# Altium project Switchberry.PrjPcb (part 1 of 3)
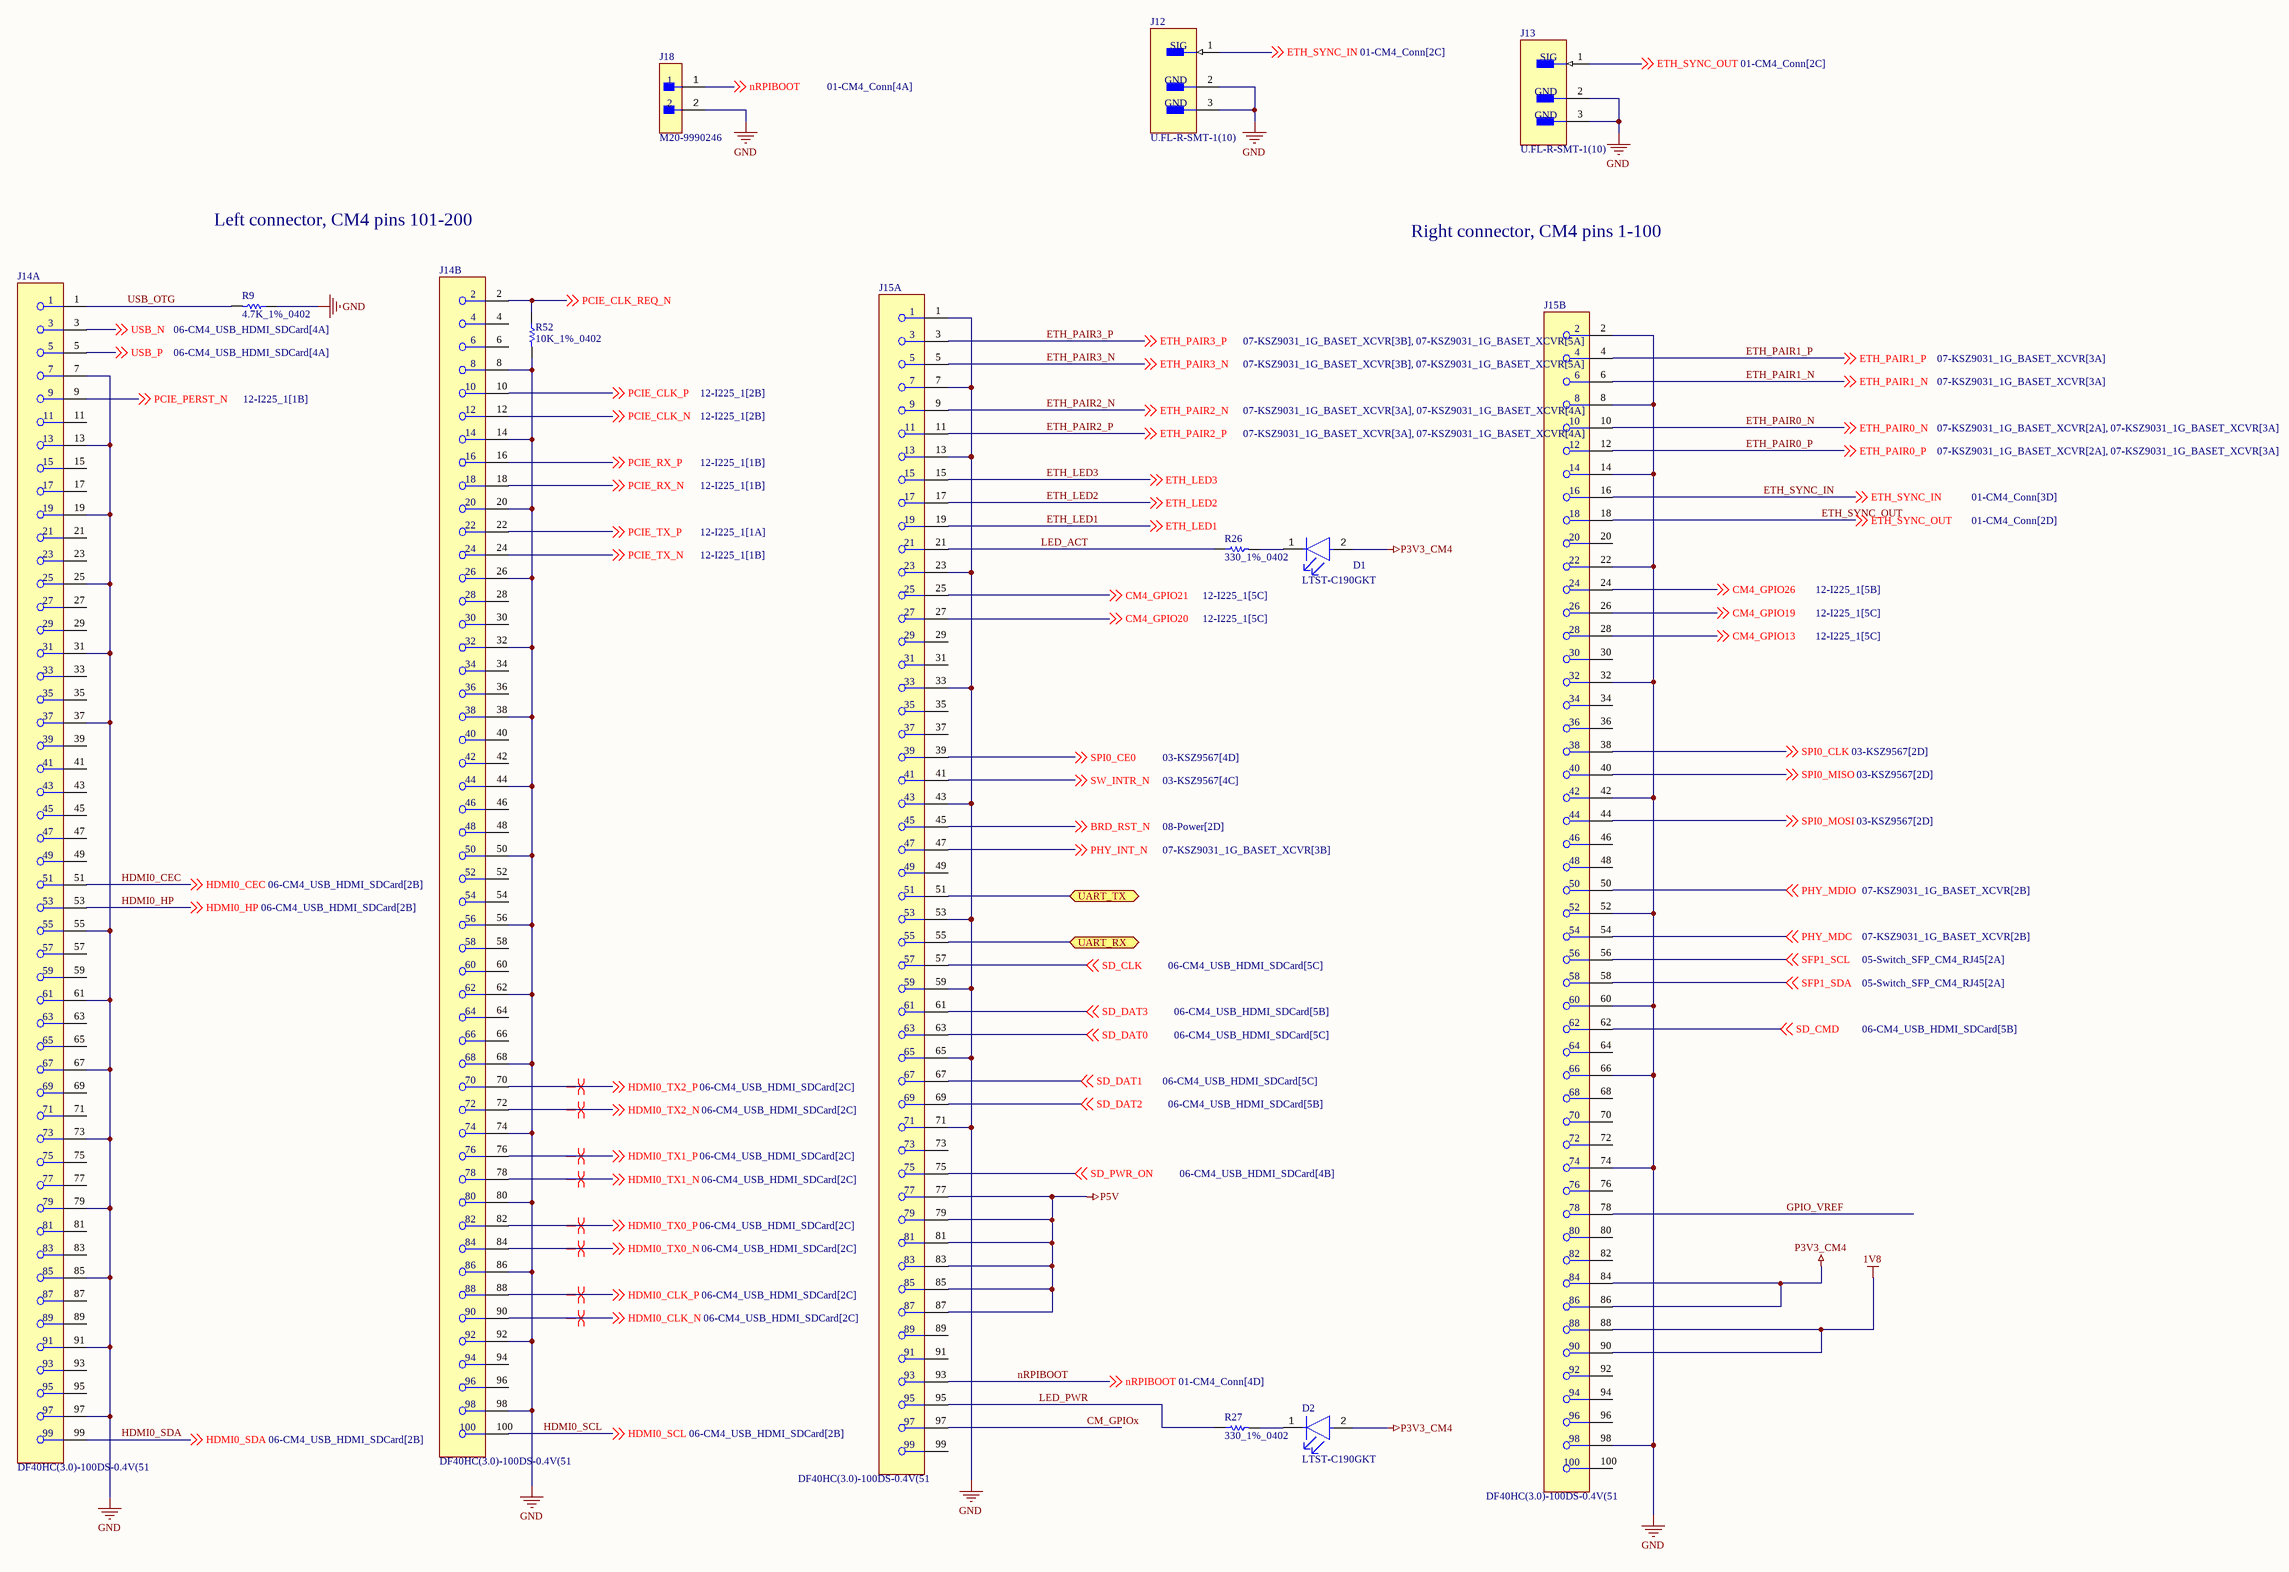
[diagram p0: 01-CM4_Conn.SchDoc]
10 sheets, 320 parts. Net scope: global (net labels, ports and power ports of the same name join across sheets).
Board file: Switchberry.PcbDoc
Sheets:
  01-CM4_Conn.SchDoc
  03-KSZ9567.SchDoc
  04-Switch_RJ45.SchDoc
  05-Switch_SFP_CM4_RJ45.SchDoc
  06-CM4_USB_HDMI_SDCard.SchDoc
  07-KSZ9031_1G_BASET_XCVR.SchDoc
  08-Power.SchDoc
  10-RJ45_Protection.SchDoc
  12-I225_1.SchDoc
  13-I225_2.SchDoc

## Sheet 01-CM4_Conn.SchDoc
size C; SheetNumber: 1; SheetTotal: 13

### Parts
D1  LTST-C190GKT  [FP-LTST-C190GKT-MFG]
D2  LTST-C190GKT  [FP-LTST-C190GKT-MFG]
J12  U.FL-R-SMT-1(10)  [FP-U_FL-R-SMT-1_10-MFG]
J13  U.FL-R-SMT-1(10)  [FP-U_FL-R-SMT-1_10-MFG]
J14  DF40HC(3.0)-100DS-0.4V(51  [FP-DF40HC_3_0_-100DS-0_4V-MFG]  (parts A,B of 2)
J15  DF40HC(3.0)-100DS-0.4V(51  [FP-DF40HC_3_0_-100DS-0_4V-MFG]  (parts A,B of 2)
J18  M20-9990246  [FP-M20-9990246-MFG]
R9  4.7K_1%_0402  [RESC1005X40X25NL10T10]
R26  330_1%_0402  [RESC1005X40X25NL10T10]
R27  330_1%_0402  [RESC1005X40X25NL10T10]
R52  10K_1%_0402  [RESC1005X40X25NL10T10]

### Ports
UART_RX (bidir), UART_TX (bidir)

### Nets
1V8: J15.88 J15.90
GND: J12.2(GND) J12.3(GND) J13.2(GND) J13.3(GND) J14.7 J14.8 J14.13 J14.14 J14.19 J14.20 J14.25 J14.26 J14.31 J14.32 J14.37 J14.38 J14.44 J14.50 J14.55 J14.56 J14.61 J14.62 J14.67 J14.68 J14.73 J14.74 J14.79 J14.80 J14.85 J14.86 J14.91 J14.92 J14.97 J14.98 J15.1 J15.2 J15.7 J15.8 J15.13 J15.14 J15.22 J15.23 J15.32 J15.33 J15.42 J15.43 J15.52 J15.53 J15.59 J15.60 J15.65 J15.66 J15.71 J15.74 J15.98 J18.2 R9.1 R52.2
P3V3_CM4: D1.2(A) D2.2(A) J15.84 J15.86
P5V: J15.77 J15.79 J15.81 J15.83 J15.85 J15.87
BRD_RST_N: J15.45 ; off-sheet BRD_RST_N
CM4_GPIO13: J15.28 ; off-sheet CM4_GPIO13
CM4_GPIO19: J15.26 ; off-sheet CM4_GPIO19
CM4_GPIO20: J15.27 ; off-sheet CM4_GPIO20
CM4_GPIO21: J15.25 ; off-sheet CM4_GPIO21
CM4_GPIO26: J15.24 ; off-sheet CM4_GPIO26
CM_GPIOx: J15.97
ETH_LED1: J15.19 ; off-sheet ETH_LED1
ETH_LED2: J15.17 ; off-sheet ETH_LED2
ETH_LED3: J15.15 ; off-sheet ETH_LED3
ETH_PAIR0_N: J15.10 ; off-sheet ETH_PAIR0_N
ETH_PAIR0_P: J15.12 ; off-sheet ETH_PAIR0_P
ETH_PAIR1_N: J15.6 ; off-sheet ETH_PAIR1_N
ETH_PAIR1_P: J15.4 ; off-sheet ETH_PAIR1_P
ETH_PAIR2_N: J15.9 ; off-sheet ETH_PAIR2_N
ETH_PAIR2_P: J15.11 ; off-sheet ETH_PAIR2_P
ETH_PAIR3_N: J15.5 ; off-sheet ETH_PAIR3_N
ETH_PAIR3_P: J15.3 ; off-sheet ETH_PAIR3_P
ETH_SYNC_IN: J12.1(SIG) J15.16 ; off-sheet ETH_SYNC_IN
ETH_SYNC_OUT: J13.1(SIG) J15.18 ; off-sheet ETH_SYNC_OUT
GPIO_VREF: J15.78
HDMI0_CEC: J14.51 ; off-sheet HDMI0_CEC
HDMI0_CLK_N: J14.90 ; off-sheet HDMI0_CLK_N
HDMI0_CLK_P: J14.88 ; off-sheet HDMI0_CLK_P
HDMI0_HP: J14.53 ; off-sheet HDMI0_HP
HDMI0_SCL: J14.100 ; off-sheet HDMI0_SCL
HDMI0_SDA: J14.99 ; off-sheet HDMI0_SDA
HDMI0_TX0_N: J14.84 ; off-sheet HDMI0_TX0_N
HDMI0_TX0_P: J14.82 ; off-sheet HDMI0_TX0_P
HDMI0_TX1_N: J14.78 ; off-sheet HDMI0_TX1_N
HDMI0_TX1_P: J14.76 ; off-sheet HDMI0_TX1_P
HDMI0_TX2_N: J14.72 ; off-sheet HDMI0_TX2_N
HDMI0_TX2_P: J14.70 ; off-sheet HDMI0_TX2_P
LED_ACT: J15.21 R26.1
LED_PWR: J15.95 R27.1
nRPIBOOT: J15.93 J18.1 ; off-sheet nRPIBOOT
PCIE_CLK_N: J14.12 ; off-sheet PCIE_CLK_N
PCIE_CLK_P: J14.10 ; off-sheet PCIE_CLK_P
PCIE_CLK_REQ_N: J14.2 R52.1 ; off-sheet PCIE_CLK_REQ_N
PCIE_PERST_N: J14.9 ; off-sheet PCIE_PERST_N
PCIE_RX_N: J14.18 ; off-sheet PCIE_RX_N
PCIE_RX_P: J14.16 ; off-sheet PCIE_RX_P
PCIE_TX_N: J14.24 ; off-sheet PCIE_TX_N
PCIE_TX_P: J14.22 ; off-sheet PCIE_TX_P
PHY_INT_N: J15.47 ; off-sheet PHY_INT_N
PHY_MDC: J15.54 ; off-sheet PHY_MDC
PHY_MDIO: J15.50 ; off-sheet PHY_MDIO
SD_CLK: J15.57 ; off-sheet SD_CLK
SD_CMD: J15.62 ; off-sheet SD_CMD
SD_DAT0: J15.63 ; off-sheet SD_DAT0
SD_DAT1: J15.67 ; off-sheet SD_DAT1
SD_DAT2: J15.69 ; off-sheet SD_DAT2
SD_DAT3: J15.61 ; off-sheet SD_DAT3
SD_PWR_ON: J15.75 ; off-sheet SD_PWR_ON
SFP1_SCL: J15.56 ; off-sheet SFP1_SCL
SFP1_SDA: J15.58 ; off-sheet SFP1_SDA
SPI0_CE0: J15.39 ; off-sheet SPI0_CE0
SPI0_CLK: J15.38 ; off-sheet SPI0_CLK
SPI0_MISO: J15.40 ; off-sheet SPI0_MISO
SPI0_MOSI: J15.44 ; off-sheet SPI0_MOSI
SW_INTR_N: J15.41 ; off-sheet SW_INTR_N
USB_N: J14.3 ; off-sheet USB_N
USB_OTG: J14.1 R9.2
USB_P: J14.5 ; off-sheet USB_P
NetD1_1: D1.1(C) R26.2
NetD2_1: D2.1(C) R27.2
NetJ15_51: J15.51 ; port UART_TX
NetJ15_55: J15.55 ; port UART_RX

Not connected (* = marked no-connect by the designer): J14 4 6 11 15 17 21 23 27 28 29 30 33 34 35 36 39 40 41 42 43 45 46 47 48 49 52 54 57 58 59 60 63 64 65 66 69 71 75 77 81 83 87 89 93 94 95 96; J15 20 29 30 31 34 35 36 37 46 48 49 64 68 70 72 73 76 80 82 89 91 92 94 96 99 100

### Layout directives
differential pair: HDMI0_CLK_N, HDMI0_CLK_P, HDMI0_TX0_N, HDMI0_TX0_P, HDMI0_TX1_N, HDMI0_TX1_P, HDMI0_TX2_N, HDMI0_TX2_P

### Notes on the sheet
- Left connector, CM4 pins 101-200
- Right connector, CM4 pins 1-100
- DWG. NO.
- REV.
- SHT.
- REVISION
- DESCRIPTION
- DATE
- APPROVED
- THIS DOCUMENT AND THE DATA DISCLOSED HEREIN OR HEREWITH IS THE PROPERTY OF ALTIUM LIMITED AND MAY BE FREELY DISTRIBUTED IN WHOLE. NO RIGHTS ARE RESERVED OR EXPRESS OR IMPLIED WARANTEE GIVEN.
- ENG:
- DSN:
- APPROVALS
- PROJECT
- DOCUMENT REVISION:
- DESIGN ITEM:
- CHK:
- BOM:
- REFERENCE DOCUMENTS
- PROJECT REVISION:
- TITLE
- FAB DWG:
- PCB DWG:
- ASSY DWG:
- SCALE:
- SIZE
- C
- CAGE CODE
- FILE NAME
- DWG NO.
- SHEET
- OF
- REV

### Library data of the parts
D1 D2 = CMP-22017-000005-2: LED GREEN CLEAR CHIP SMD; Dominant Wavelength: 569nm; Reverse Voltage: 5V; Lens Color: Colorless; Viewing Angle: 130°; Voltage: 2V; Forward Current: 30mA; Power Dissipation: 100mW; Luminous Intensity: 6mcd; Number of LEDs: 1; Forward Voltage: 2.1V; Wavelength: 565nm; Test Current: 10mA; Min Operating Temperature: -55°C; Lens Style: Clear; Mount: Surface Mount; Width: 0.8mm; Packaging: Tape and Reel; Lens Transparency: Clear; Case Code (Metric): 1608; Depth: 0.8mm; Case Code (Imperial): 0603; Case/Package: 0603; Number of Pins: 2; Max Operating Temperature: 85°C; Lead Free: Lead Free; Number of Elements: 1; Length: 1.6mm; Height: 0.8mm; Package Quantity: 1; Power Rating: 100mW; Radiation Hardening: No; Illumination Color: Green; Color: Green
J12 J13 = CMP-2000-05152-3: CONN U.FL RCPT STR 50 OHM SMD; Max Frequency: 6GHz; Connector Type: Coaxial; Body Plating: Silver; Body Material: Bronze; Impedance: 50R; Dielectric Material: Polymer; Insulation Resistance: 500MR; Gender: Male; Packaging: Cut Tape; Length: 3mm; Package Quantity: 2500; Termination: Solder; Lead Free: Lead Free; Series: U.FL; Min Operating Temperature: -40°C; Fastening Type: Snap; Contact Material: Brass; Orientation: Straight; Wire/Cable Type: Coaxial; Frequency: 6GHz; Contact Plating: Gold; Depth: 3.1mm; Weight: 0.001764oz; Max Operating Temperature: 90°C; Radiation Hardening: No; REACH SVHC: No SVHC; Mount: Surface Mount; Housing Color: Beige
J14 J15 = CMP-11605-000071-1: CONN RCPT 100POS SMD GOLD; Pitch: 0.016inch; Number of Positions: 100; Connector Type: Receptacle; Package Quantity: 3000; Contact Plating: Gold; Series: DF40; Mount: Surface Mount; Number of Rows: 2; Packaging: Tape and Reel
J18 = CMP-15831-000009-1: CONN HEADER VERT 2POS 2.54MM; Manufacturer: Harwin; Conn Gender: Male; Conn Orientation: Vertical; Number Of Contacts: 2; Current Rating: 3A; ComponentLink2URL: https://cdn.harwin.com/pdfs/M20-999.pdf; ComponentLink2Description: Datasheet; Package: M20-9990246; Temperature: -40°C to +105°C; Octopart: https://octopart.com/m20-9990246-harwin-2590635; Mouser Description: 2.54mm (0.1") Pitch SIL Vertical PC Tail Pin Header, 6.1mm mating pin height, tin, 2 contacts; Temperature Range High: +105°C; Device Class L1: Connectors; RoHS: TRUE; Automotive: No; Height: 8.99mm; Number Of Rows: 1; Contact Material: Tin,Nickel; Category: Conn; Pitch: 2.54mm; Lead Free: Yes; Digikey Description: CONN HEADER VERT 2POS 2.54MM; Manufacturer Part Number: M20-9990246; Temperature Range Low: -40°C; Device Class L3: unset; Device Class L2: Headers and Wire Housings
R9 = CMP-2002-05217-1: Manufacturer: Bourns; Part Number: CR0402-FX-4701GLF
R26 R27 = CMP-2002-05853-1: Manufacturer: Panasonic; Part Number: ERA-2AED331X
R52 = CMP-2002-04694-1: Manufacturer: Bourns; Part Number: CR0402-FX-1002GLF

## Sheet 03-KSZ9567.SchDoc
size B; SheetNumber: 3; SheetTotal: 11
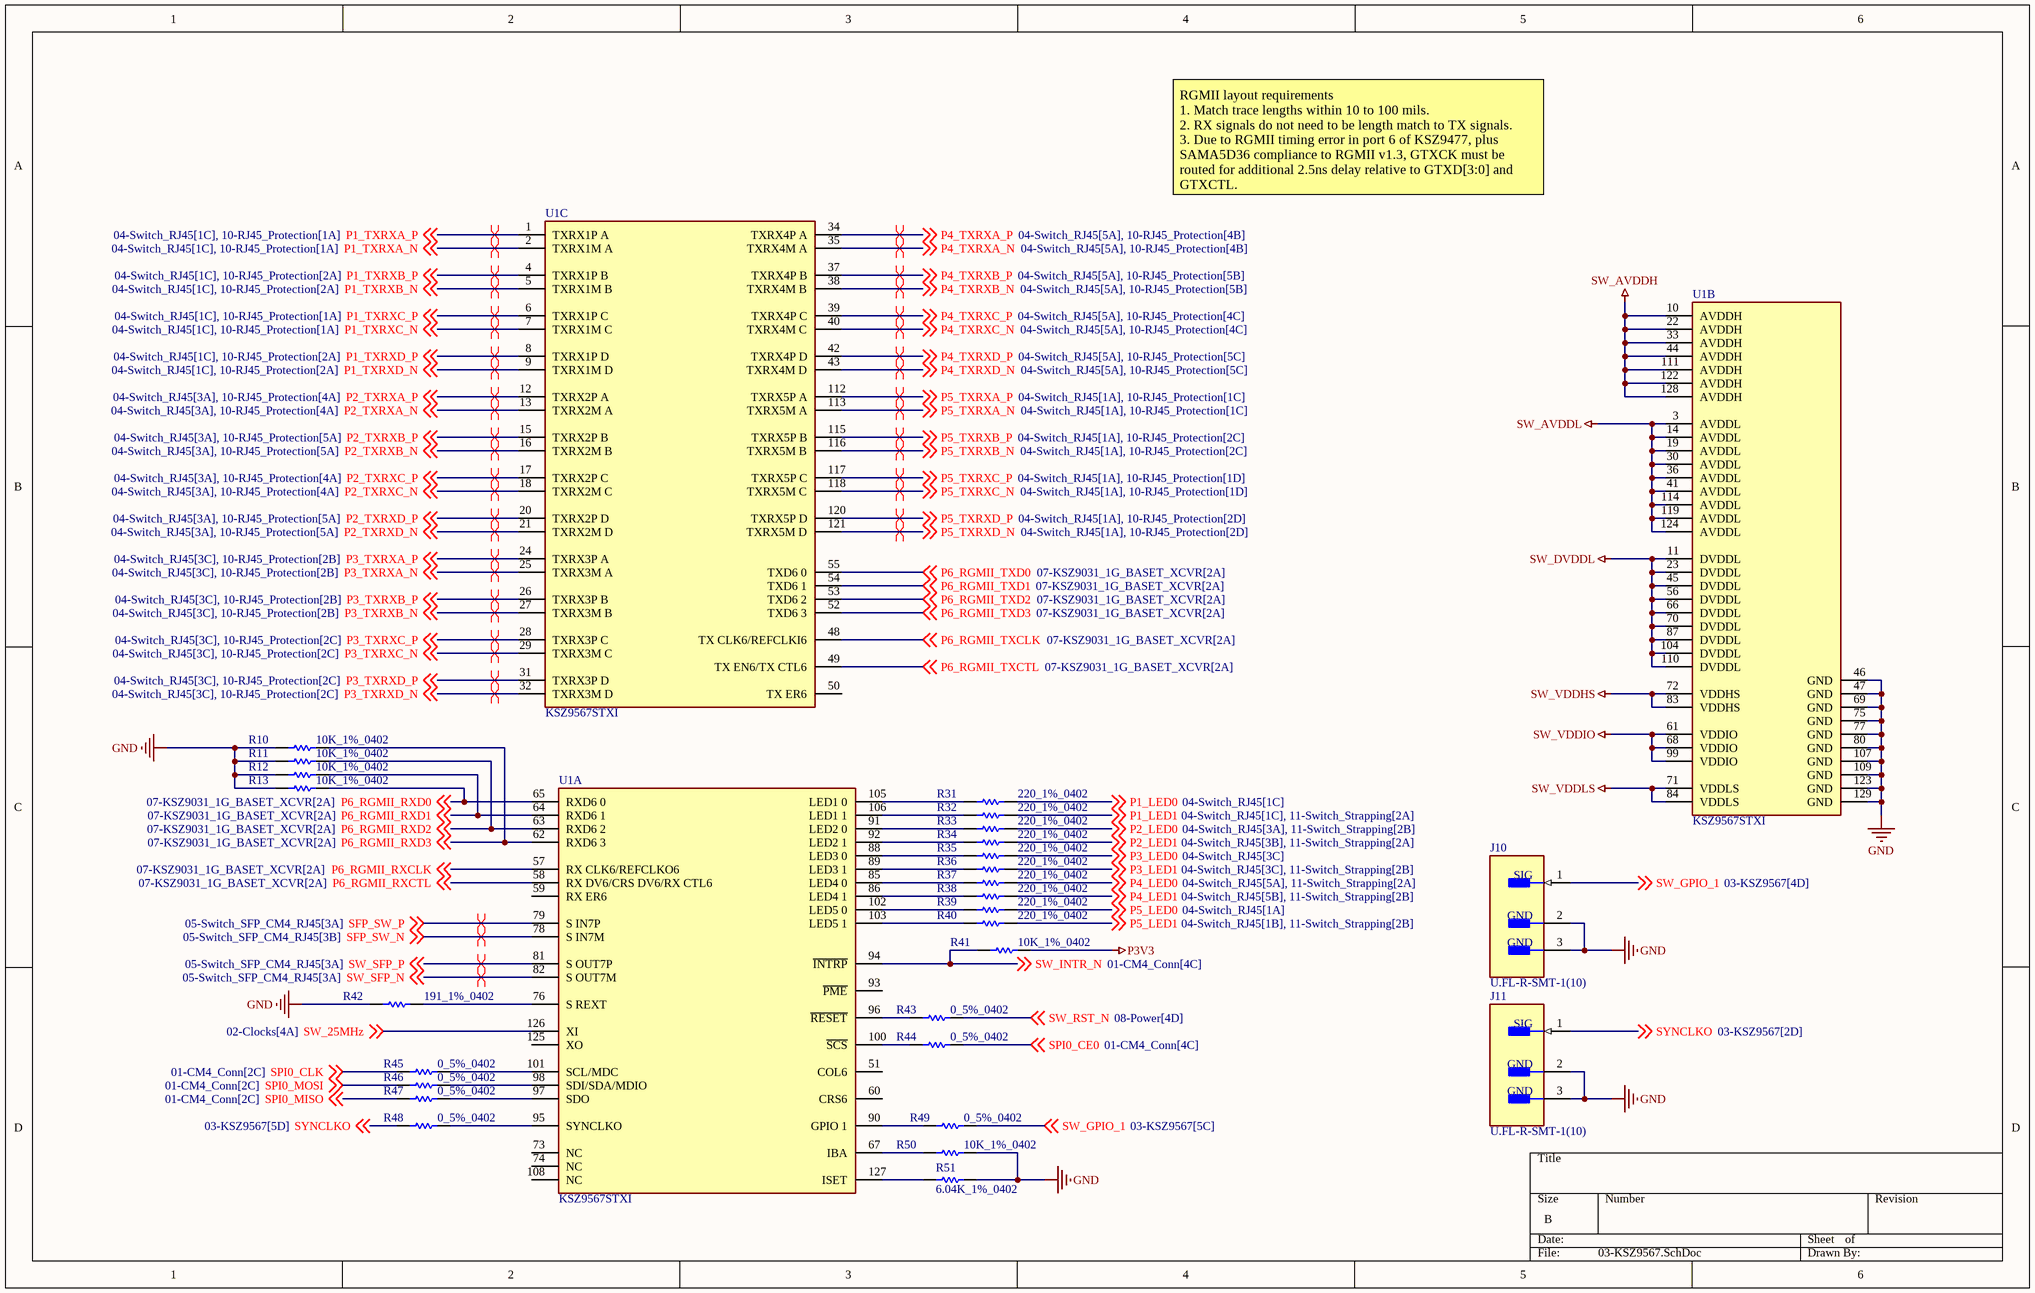
[diagram p1: 03-KSZ9567.SchDoc]

### Parts
J10  U.FL-R-SMT-1(10)  [FP-U_FL-R-SMT-1_10-MFG]
J11  U.FL-R-SMT-1(10)  [FP-U_FL-R-SMT-1_10-MFG]
R10  10K_1%_0402  [RESC1005X40X25NL10T10]
R11  10K_1%_0402  [RESC1005X40X25NL10T10]
R12  10K_1%_0402  [RESC1005X40X25NL10T10]
R13  10K_1%_0402  [RESC1005X40X25NL10T10]
R31  220_1%_0402  [RESC1005X40X25NL05T10]
R32  220_1%_0402  [RESC1005X40X25NL05T10]
R33  220_1%_0402  [RESC1005X40X25NL05T10]
R34  220_1%_0402  [RESC1005X40X25NL05T10]
R35  220_1%_0402  [RESC1005X40X25NL05T10]
R36  220_1%_0402  [RESC1005X40X25NL05T10]
R37  220_1%_0402  [RESC1005X40X25NL05T10]
R38  220_1%_0402  [RESC1005X40X25NL05T10]
R39  220_1%_0402  [RESC1005X40X25NL05T10]
R40  220_1%_0402  [RESC1005X40X25NL05T10]
R41  10K_1%_0402  [RESC1005X40X25NL10T10]
R42  191_1%_0402  [RESC1005X40X25LL10T10]
R43  0_5%_0402  [RESC1005X40X25NL05T10]
R44  0_5%_0402  [RESC1005X40X25NL05T10]
R45  0_5%_0402  [RESC1005X40X25NL05T10]
R46  0_5%_0402  [RESC1005X40X25NL05T10]
R47  0_5%_0402  [RESC1005X40X25NL05T10]
R48  0_5%_0402  [RESC1005X40X25NL05T10]
R49  0_5%_0402  [RESC1005X40X25NL05T10]
R50  10K_1%_0402  [RESC1005X40X25NL10T10]
R51  6.04K_1%_0402  [RESC1005X40X25NL10T10]
U1  KSZ9567STXI  [FP-C04-418-IPC_A]  (parts A,B,C of 3)

### Nets
GND: J10.2(GND) J10.3(GND) J11.2(GND) J11.3(GND) R10.1 R11.1 R12.1 R13.1 R42.1 R50.2 R51.2 U1.46(GND) U1.47(GND) U1.69(GND) U1.75(GND) U1.77(GND) U1.80(GND) U1.107(GND) U1.109(GND) U1.123(GND) U1.129(GND)
P3V3: R41.2
SW_AVDDH: U1.10(AVDDH) U1.22(AVDDH) U1.33(AVDDH) U1.44(AVDDH) U1.111(AVDDH) U1.122(AVDDH) U1.128(AVDDH)
SW_AVDDL: U1.3(AVDDL) U1.14(AVDDL) U1.19(AVDDL) U1.30(AVDDL) U1.36(AVDDL) U1.41(AVDDL) U1.114(AVDDL) U1.119(AVDDL) U1.124(AVDDL)
SW_DVDDL: U1.11(DVDDL) U1.23(DVDDL) U1.45(DVDDL) U1.56(DVDDL) U1.66(DVDDL) U1.70(DVDDL) U1.87(DVDDL) U1.104(DVDDL) U1.110(DVDDL)
SW_VDDHS: U1.72(VDDHS) U1.83(VDDHS)
SW_VDDIO: U1.61(VDDIO) U1.68(VDDIO) U1.99(VDDIO)
SW_VDDLS: U1.71(VDDLS) U1.84(VDDLS)
P1_LED0: R31.2 ; off-sheet P1_LED0
P1_LED1: R32.2 ; off-sheet P1_LED1
P1_TXRXA_N: U1.2(TXRX1M_A) ; off-sheet P1_TXRXA_N
P1_TXRXA_P: U1.1(TXRX1P_A) ; off-sheet P1_TXRXA_P
P1_TXRXB_N: U1.5(TXRX1M_B) ; off-sheet P1_TXRXB_N
P1_TXRXB_P: U1.4(TXRX1P_B) ; off-sheet P1_TXRXB_P
P1_TXRXC_N: U1.7(TXRX1M_C) ; off-sheet P1_TXRXC_N
P1_TXRXC_P: U1.6(TXRX1P_C) ; off-sheet P1_TXRXC_P
P1_TXRXD_N: U1.9(TXRX1M_D) ; off-sheet P1_TXRXD_N
P1_TXRXD_P: U1.8(TXRX1P_D) ; off-sheet P1_TXRXD_P
P2_LED0: R33.2 ; off-sheet P2_LED0
P2_LED1: R34.2 ; off-sheet P2_LED1
P2_TXRXA_N: U1.13(TXRX2M_A) ; off-sheet P2_TXRXA_N
P2_TXRXA_P: U1.12(TXRX2P_A) ; off-sheet P2_TXRXA_P
P2_TXRXB_N: U1.16(TXRX2M_B) ; off-sheet P2_TXRXB_N
P2_TXRXB_P: U1.15(TXRX2P_B) ; off-sheet P2_TXRXB_P
P2_TXRXC_N: U1.18(TXRX2M_C) ; off-sheet P2_TXRXC_N
P2_TXRXC_P: U1.17(TXRX2P_C) ; off-sheet P2_TXRXC_P
P2_TXRXD_N: U1.21(TXRX2M_D) ; off-sheet P2_TXRXD_N
P2_TXRXD_P: U1.20(TXRX2P_D) ; off-sheet P2_TXRXD_P
P3_LED0: R35.2 ; off-sheet P3_LED0
P3_LED1: R36.2 ; off-sheet P3_LED1
P3_TXRXA_N: U1.25(TXRX3M_A) ; off-sheet P3_TXRXA_N
P3_TXRXA_P: U1.24(TXRX3P_A) ; off-sheet P3_TXRXA_P
P3_TXRXB_N: U1.27(TXRX3M_B) ; off-sheet P3_TXRXB_N
P3_TXRXB_P: U1.26(TXRX3P_B) ; off-sheet P3_TXRXB_P
P3_TXRXC_N: U1.29(TXRX3M_C) ; off-sheet P3_TXRXC_N
P3_TXRXC_P: U1.28(TXRX3P_C) ; off-sheet P3_TXRXC_P
P3_TXRXD_N: U1.32(TXRX3M_D) ; off-sheet P3_TXRXD_N
P3_TXRXD_P: U1.31(TXRX3P_D) ; off-sheet P3_TXRXD_P
P4_LED0: R37.2 ; off-sheet P4_LED0
P4_LED1: R38.2 ; off-sheet P4_LED1
P4_TXRXA_N: U1.35(TXRX4M_A) ; off-sheet P4_TXRXA_N
P4_TXRXA_P: U1.34(TXRX4P_A) ; off-sheet P4_TXRXA_P
P4_TXRXB_N: U1.38(TXRX4M_B) ; off-sheet P4_TXRXB_N
P4_TXRXB_P: U1.37(TXRX4P_B) ; off-sheet P4_TXRXB_P
P4_TXRXC_N: U1.40(TXRX4M_C) ; off-sheet P4_TXRXC_N
P4_TXRXC_P: U1.39(TXRX4P_C) ; off-sheet P4_TXRXC_P
P4_TXRXD_N: U1.43(TXRX4M_D) ; off-sheet P4_TXRXD_N
P4_TXRXD_P: U1.42(TXRX4P_D) ; off-sheet P4_TXRXD_P
P5_LED0: R39.2 ; off-sheet P5_LED0
P5_LED1: R40.2 ; off-sheet P5_LED1
P5_TXRXA_N: U1.113(TXRX5M_A) ; off-sheet P5_TXRXA_N
P5_TXRXA_P: U1.112(TXRX5P_A) ; off-sheet P5_TXRXA_P
P5_TXRXB_N: U1.116(TXRX5M_B) ; off-sheet P5_TXRXB_N
P5_TXRXB_P: U1.115(TXRX5P_B) ; off-sheet P5_TXRXB_P
P5_TXRXC_N: U1.118(TXRX5M_C) ; off-sheet P5_TXRXC_N
P5_TXRXC_P: U1.117(TXRX5P_C) ; off-sheet P5_TXRXC_P
P5_TXRXD_N: U1.121(TXRX5M_D) ; off-sheet P5_TXRXD_N
P5_TXRXD_P: U1.120(TXRX5P_D) ; off-sheet P5_TXRXD_P
P6_RGMII_RXCLK: U1.57(RX_CLK6/REFCLKO6) ; off-sheet P6_RGMII_RXCLK
P6_RGMII_RXCTL: U1.58(RX_DV6/CRS_DV6/RX_CTL6) ; off-sheet P6_RGMII_RXCTL
P6_RGMII_RXD0: R13.2 U1.65(RXD6_0) ; off-sheet P6_RGMII_RXD0
P6_RGMII_RXD1: R12.2 U1.64(RXD6_1) ; off-sheet P6_RGMII_RXD1
P6_RGMII_RXD2: R11.2 U1.63(RXD6_2) ; off-sheet P6_RGMII_RXD2
P6_RGMII_RXD3: R10.2 U1.62(RXD6_3) ; off-sheet P6_RGMII_RXD3
P6_RGMII_TXCLK: U1.48(TX_CLK6/REFCLKI6) ; off-sheet P6_RGMII_TXCLK
P6_RGMII_TXCTL: U1.49(TX_EN6/TX_CTL6) ; off-sheet P6_RGMII_TXCTL
P6_RGMII_TXD0: U1.55(TXD6_0) ; off-sheet P6_RGMII_TXD0
P6_RGMII_TXD1: U1.54(TXD6_1) ; off-sheet P6_RGMII_TXD1
P6_RGMII_TXD2: U1.53(TXD6_2) ; off-sheet P6_RGMII_TXD2
P6_RGMII_TXD3: U1.52(TXD6_3) ; off-sheet P6_RGMII_TXD3
SFP_SW_N: U1.78(S_IN7M) ; off-sheet SFP_SW_N
SFP_SW_P: U1.79(S_IN7P) ; off-sheet SFP_SW_P
SPI0_CE0: R44.2 ; off-sheet SPI0_CE0
SPI0_CLK: R45.1 ; off-sheet SPI0_CLK
SPI0_MISO: R47.1 ; off-sheet SPI0_MISO
SPI0_MOSI: R46.1 ; off-sheet SPI0_MOSI
SW_25MHz: U1.126(XI) ; off-sheet SW_25MHz
SW_GPIO_1: J10.1(SIG) R49.2 ; off-sheet SW_GPIO_1
SW_INTR_N: R41.1 U1.94(~{INTRP}) ; off-sheet SW_INTR_N
SW_RST_N: R43.2 ; off-sheet SW_RST_N
SW_SFP_N: U1.82(S_OUT7M) ; off-sheet SW_SFP_N
SW_SFP_P: U1.81(S_OUT7P) ; off-sheet SW_SFP_P
SYNCLKO: J11.1(SIG) R48.1 ; off-sheet SYNCLKO
NetR31_1: R31.1 U1.105(LED1_0)
NetR32_1: R32.1 U1.106(LED1_1)
NetR33_1: R33.1 U1.91(LED2_0)
NetR34_1: R34.1 U1.92(LED2_1)
NetR35_1: R35.1 U1.88(LED3_0)
NetR36_1: R36.1 U1.89(LED3_1)
NetR37_1: R37.1 U1.85(LED4_0)
NetR38_1: R38.1 U1.86(LED4_1)
NetR39_1: R39.1 U1.102(LED5_0)
NetR40_1: R40.1 U1.103(LED5_1)
NetR42_2: R42.2 U1.76(S_REXT)
NetR43_1: R43.1 U1.96(~{RESET})
NetR44_1: R44.1 U1.100(~{SCS})
NetR45_2: R45.2 U1.101(SCL/MDC)
NetR46_2: R46.2 U1.98(SDI/SDA/MDIO)
NetR47_2: R47.2 U1.97(SDO)
NetR48_2: R48.2 U1.95(SYNCLKO)
NetR49_1: R49.1 U1.90(GPIO_1)
NetR50_1: R50.1 U1.67(IBA)
NetR51_1: R51.1 U1.127(ISET)

Not connected (* = marked no-connect by the designer): U1 50(TX_ER6) 51(COL6) 59(RX_ER6) 60(CRS6) 73(NC) 74(NC) 93(~{PME}) 108(NC) 125(XO)

### Layout directives
differential pair: P1_TXRXA_N, P1_TXRXA_P, P1_TXRXB_N, P1_TXRXB_P, P1_TXRXC_N, P1_TXRXC_P, P1_TXRXD_N, P1_TXRXD_P, P2_TXRXA_N, P2_TXRXA_P, P2_TXRXB_N, P2_TXRXB_P, P2_TXRXC_N, P2_TXRXC_P, P2_TXRXD_N, P2_TXRXD_P, P3_TXRXA_N, P3_TXRXA_P, P3_TXRXB_N, P3_TXRXB_P, P3_TXRXC_N, P3_TXRXC_P, P3_TXRXD_N, P3_TXRXD_P, P4_TXRXA_N, P4_TXRXA_P, P4_TXRXB_N, P4_TXRXB_P, P4_TXRXC_N, P4_TXRXC_P, P4_TXRXD_N, P4_TXRXD_P, P5_TXRXA_N, P5_TXRXA_P, P5_TXRXB_N, P5_TXRXB_P, P5_TXRXC_N, P5_TXRXC_P, P5_TXRXD_N, P5_TXRXD_P, SFP_SW_N, SFP_SW_P, SW_SFP_N, SW_SFP_P

### Notes on the sheet
- RGMII layout requirements
  1. Match trace lengths within 10 to 100 mils.
  2. RX signals do not need to be length match to TX signals.
  3. Due to RGMII timing error in port 6 of KSZ9477, plus SAMA5D36 compliance to RGMII v1.3, GTXCK must be routed for additional 2.5ns delay relative to GTXD[3:0] and GTXCTL.

### Library data of the parts
J10 J11 = CMP-2000-05152-3: as J12 on sheet 01-CM4_Conn; Packaging: Cut Tape; Length: 3mm; Package Quantity: 2500; Termination: Solder; Lead Free: Lead Free; Series: U.FL; Min Operating Temperature: -40°C; Fastening Type: Snap; Contact Material: Brass; Orientation: Straight; Wire/Cable Type: Coaxial; Frequency: 6GHz; Contact Plating: Gold; Depth: 3.1mm; Weight: 0.001764oz; Max Operating Temperature: 90°C; Radiation Hardening: No; REACH SVHC: No SVHC; Mount: Surface Mount; Housing Color: Beige
R10-R13 R41 R50 = CMP-2002-04694-1: as R52 on sheet 01-CM4_Conn
R31-R40 = CMP-2002-07959-1: Manufacturer: Yageo / Phycomp; Part Number: RC0402JR-07220RL
R42 = CMP-2002-04891-1: Manufacturer: Bourns; Part Number: CR0402-FX-1910GLF
R43-R49 = CMP-2002-06457-1: Manufacturer: Panasonic; Part Number: ERJ-U020R00X
R51 = CMP-2002-06319-1: Manufacturer: Multicomp; Part Number: MC00625W040216K04
U1 = CMP-06281-000207-1: IC ETHERNET SWITCH 7PORT 128TQFP; Interface: I2C; Max Operating Temperature: 85°C; Min Operating Temperature: -40°C; Packaging: Tray; RoHS Compliant: Yes

## Sheet 04-Switch_RJ45.SchDoc
size C; SheetNumber: 4; SheetTotal: 13
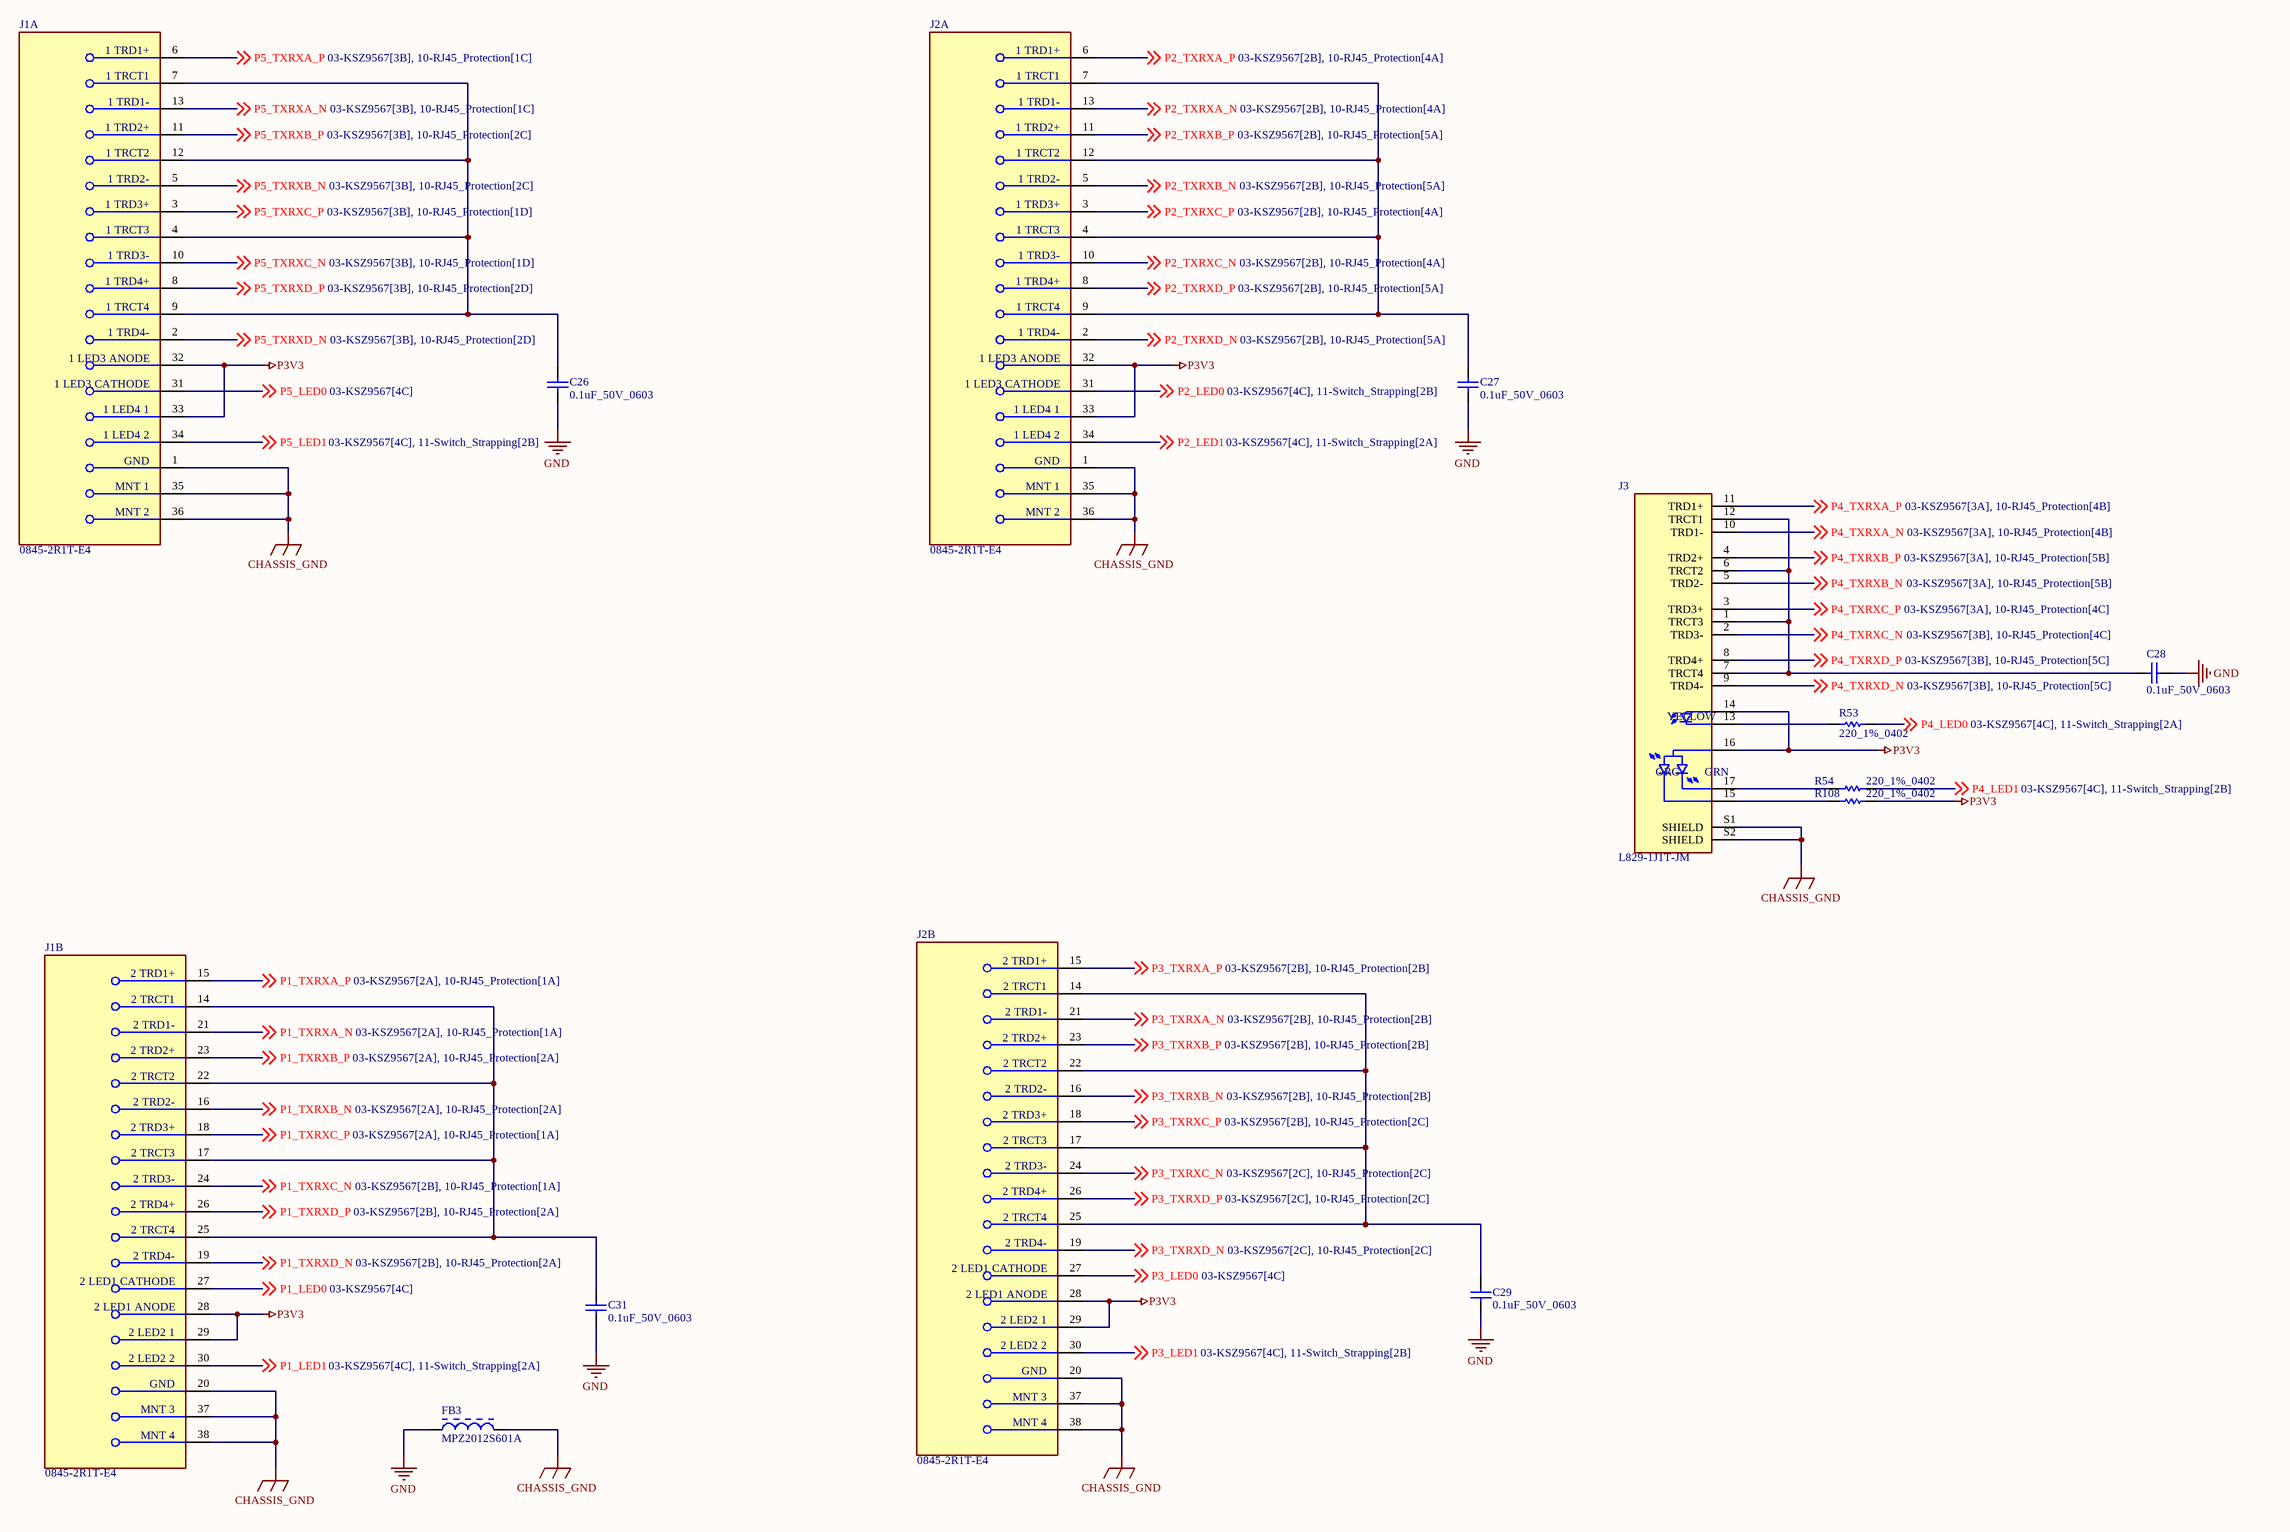
[diagram p2: 04-Switch_RJ45.SchDoc]

### Parts
C26  0.1uF_50V_0603  [CAPC1608X90X35ML10T15]
C27  0.1uF_50V_0603  [CAPC1608X90X35ML10T15]
C28  0.1uF_50V_0603  [CAPC1608X90X35ML10T15]
C29  0.1uF_50V_0603  [CAPC1608X90X35ML10T15]
C31  0.1uF_50V_0603  [CAPC1608X90X35ML10T15]
FB3  MPZ2012S601A  [TDK-MPZ2012_V]
J1  0845-2R1T-E4  [FP-0845-2R1T-E4-MFG]  (parts A,B of 2)
J2  0845-2R1T-E4  [FP-0845-2R1T-E4-MFG]  (parts A,B of 2)
J3  L829-1J1T-JM  [BEL_L829-1J1T-JM]
R53  220_1%_0402  [RESC1005X40X25LL10T10]
R54  220_1%_0402  [RESC1005X40X25LL10T10]
R108  220_1%_0402  [RESC1005X40X25LL10T10]

### Nets
CHASSIS_GND: FB3.2 J1.1(GND) J1.20(GND) J1.35(MNT_1) J1.36(MNT_2) J1.37(MNT_3) J1.38(MNT_4) J2.1(GND) J2.20(GND) J2.35(MNT_1) J2.36(MNT_2) J2.37(MNT_3) J2.38(MNT_4) J3.S1(SHIELD) J3.S2(SHIELD)
GND: C26.1 C27.1 C28.1 C29.1 C31.1 FB3.1
P3V3: J1.28(2_LED1_ANODE) J1.29(2_LED2_1) J1.32(1_LED3_ANODE) J1.33(1_LED4_1) J2.28(2_LED1_ANODE) J2.29(2_LED2_1) J2.32(1_LED3_ANODE) J2.33(1_LED4_1) J3.14(YA_1) J3.16(CA) R108.2
P1_LED0: J1.27(2_LED1_CATHODE) ; off-sheet P1_LED0
P1_LED1: J1.30(2_LED2_2) ; off-sheet P1_LED1
P1_TXRXA_N: J1.21(2_TRD1-) ; off-sheet P1_TXRXA_N
P1_TXRXA_P: J1.15(2_TRD1+) ; off-sheet P1_TXRXA_P
P1_TXRXB_N: J1.16(2_TRD2-) ; off-sheet P1_TXRXB_N
P1_TXRXB_P: J1.23(2_TRD2+) ; off-sheet P1_TXRXB_P
P1_TXRXC_N: J1.24(2_TRD3-) ; off-sheet P1_TXRXC_N
P1_TXRXC_P: J1.18(2_TRD3+) ; off-sheet P1_TXRXC_P
P1_TXRXD_N: J1.19(2_TRD4-) ; off-sheet P1_TXRXD_N
P1_TXRXD_P: J1.26(2_TRD4+) ; off-sheet P1_TXRXD_P
P2_LED0: J2.31(1_LED3_CATHODE) ; off-sheet P2_LED0
P2_LED1: J2.34(1_LED4_2) ; off-sheet P2_LED1
P2_TXRXA_N: J2.13(1_TRD1-) ; off-sheet P2_TXRXA_N
P2_TXRXA_P: J2.6(1_TRD1+) ; off-sheet P2_TXRXA_P
P2_TXRXB_N: J2.5(1_TRD2-) ; off-sheet P2_TXRXB_N
P2_TXRXB_P: J2.11(1_TRD2+) ; off-sheet P2_TXRXB_P
P2_TXRXC_N: J2.10(1_TRD3-) ; off-sheet P2_TXRXC_N
P2_TXRXC_P: J2.3(1_TRD3+) ; off-sheet P2_TXRXC_P
P2_TXRXD_N: J2.2(1_TRD4-) ; off-sheet P2_TXRXD_N
P2_TXRXD_P: J2.8(1_TRD4+) ; off-sheet P2_TXRXD_P
P3_LED0: J2.27(2_LED1_CATHODE) ; off-sheet P3_LED0
P3_LED1: J2.30(2_LED2_2) ; off-sheet P3_LED1
P3_TXRXA_N: J2.21(2_TRD1-) ; off-sheet P3_TXRXA_N
P3_TXRXA_P: J2.15(2_TRD1+) ; off-sheet P3_TXRXA_P
P3_TXRXB_N: J2.16(2_TRD2-) ; off-sheet P3_TXRXB_N
P3_TXRXB_P: J2.23(2_TRD2+) ; off-sheet P3_TXRXB_P
P3_TXRXC_N: J2.24(2_TRD3-) ; off-sheet P3_TXRXC_N
P3_TXRXC_P: J2.18(2_TRD3+) ; off-sheet P3_TXRXC_P
P3_TXRXD_N: J2.19(2_TRD4-) ; off-sheet P3_TXRXD_N
P3_TXRXD_P: J2.26(2_TRD4+) ; off-sheet P3_TXRXD_P
P4_LED0: R53.2 ; off-sheet P4_LED0
P4_LED1: R54.2 ; off-sheet P4_LED1
P4_TXRXA_N: J3.10(TRD1-) ; off-sheet P4_TXRXA_N
P4_TXRXA_P: J3.11(TRD1+) ; off-sheet P4_TXRXA_P
P4_TXRXB_N: J3.5(TRD2-) ; off-sheet P4_TXRXB_N
P4_TXRXB_P: J3.4(TRD2+) ; off-sheet P4_TXRXB_P
P4_TXRXC_N: J3.2(TRD3-) ; off-sheet P4_TXRXC_N
P4_TXRXC_P: J3.3(TRD3+) ; off-sheet P4_TXRXC_P
P4_TXRXD_N: J3.9(TRD4-) ; off-sheet P4_TXRXD_N
P4_TXRXD_P: J3.8(TRD4+) ; off-sheet P4_TXRXD_P
P5_LED0: J1.31(1_LED3_CATHODE) ; off-sheet P5_LED0
P5_LED1: J1.34(1_LED4_2) ; off-sheet P5_LED1
P5_TXRXA_N: J1.13(1_TRD1-) ; off-sheet P5_TXRXA_N
P5_TXRXA_P: J1.6(1_TRD1+) ; off-sheet P5_TXRXA_P
P5_TXRXB_N: J1.5(1_TRD2-) ; off-sheet P5_TXRXB_N
P5_TXRXB_P: J1.11(1_TRD2+) ; off-sheet P5_TXRXB_P
P5_TXRXC_N: J1.10(1_TRD3-) ; off-sheet P5_TXRXC_N
P5_TXRXC_P: J1.3(1_TRD3+) ; off-sheet P5_TXRXC_P
P5_TXRXD_N: J1.2(1_TRD4-) ; off-sheet P5_TXRXD_N
P5_TXRXD_P: J1.8(1_TRD4+) ; off-sheet P5_TXRXD_P
NetC26_2: C26.2 J1.4(1_TRCT3) J1.7(1_TRCT1) J1.9(1_TRCT4) J1.12(1_TRCT2)
NetC27_2: C27.2 J2.4(1_TRCT3) J2.7(1_TRCT1) J2.9(1_TRCT4) J2.12(1_TRCT2)
NetC28_2: C28.2 J3.1(TRCT3) J3.6(TRCT2) J3.7(TRCT4) J3.12(TRCT1)
NetC29_2: C29.2 J2.14(2_TRCT1) J2.17(2_TRCT3) J2.22(2_TRCT2) J2.25(2_TRCT4)
NetC31_2: C31.2 J1.14(2_TRCT1) J1.17(2_TRCT3) J1.22(2_TRCT2) J1.25(2_TRCT4)
NetJ3_13: J3.13(YK_1) R53.1
NetJ3_15: J3.15(OK_1) R108.1
NetJ3_17: J3.17(GK_1) R54.1

### Notes on the sheet
- (in symbol L829-1J1T-JM) YELLOW; ORG; GRN

### Library data of the parts
C26-C29 C31 = CMP-2100-03643-1: Chip Capacitor, 0.1 uF, +/- 10%, 50 V, -55 to 125 degC, 0603 (1608 Metric), RoHS, Tape and Reel; Manufacturer: Murata; Dielectric Material: Ceramic; Voltage Rating: 50V; Capacitance: 100nF; Dielectric: X7R; Insulation Resistance: 10GR; Case Code (Metric): 1608; Lead Free: LeadFree; Depth: 0.8mm; Number of Pins: 2; Radiation Hardening: No; Case/Package: 0603; Manufacturer URL: http://www.murata.com/; Packaging: TapeandReel; Length: 1.6mm; Contact Plating: Tin; Datasheet URL: http://psearch.en.murata.com/capacitor/product/GRM188R71H104KA93%23.pdf; Tolerance: 10%; Case Code (Imperial): 0603; Min Operating Temperature: -55degC; RoHSCompliant: true; Voltage: 50V; Termination: SMD/SMT; Mount: SurfaceMount; Material: Ceramic; Package Quantity: 1; Height: 0.8mm; Thickness: 0.035inch; REACH SVHC: NoSVHC; Max Operating Temperature: 125degC; Width: 0.8mm; Package Reference: 0603; Voltage Rating (DC): 50V; Datasheet Version: 42675.0; Package Description: 2-Pin Surface Mount Device, Body 1.6 x 0.8 mm
FB3 = CMP-2000-05400-1: Chip Bead for Power Line, 600 Ohm, +/- 25%, 2 A, -55 to 125 degC, 2-Pin SMD (0805), RoHS, Tape and Reel; Manufacturer: TDK; Maximum DC Current: 2A; Impedance: 600Ohms; Test Frequency: 100MHz; Case Length: 2mm; Maximum DC Resistance: 100mOhms; Case Height: 0.85mm; Case Width: 1.25mm; Factory Pack Quantity: 4000; Operating Temperature Range: -55Cto+125C; Packaging: Reel; Datasheet URL: https://datasheet.ciiva.com/23763/1750041-23763249.pdf; Manufacturer URL: http://www.tdk.com/; Product Category: EMIFilterBeads,Chips&Arrays; Tolerance: 25%; Product: FerriteChipBeads; Package / Case: 0805(2012metric); RoHS: Details; Dimensions: 1.25mmWx2mmLx0.85mmH; Datasheet Version: Jul-13; Termination Style: SMD/SMT; Package Reference: 805; Brand: TDK; Package Description: 2-Pin Surface Mount Device, Body 2 x 1.25 mm
J1 J2 = CMP-16034-000001-1: CONN MAGJACK 2PORT 1000 BASE-T; Manufacturer: Bel Fuse; Is Female: yes; Number Of Contacts: 26; Pitch: 2.01mm; Conn Gender: Female; Shielding: false; Conn Orientation: Horizontal; Digikey Description: CONN MAGJACK 2PORT 1000 BASE-T; Temperature Range High: +70°C; Device Class L2: Modular / Ethernet Connectors; Mouser Description: Conn RJ-45 F 16 POS 2.01mm Solder RA Thru-Hole 34 Terminal 2 Port Tray; Automotive: No; Height: 1.155inch; Category: Conn; Contact Material: Gold,Nickel; ComponentLink2URL: https://www.belfuse.com/resources/drawings/magneticsolutions/dr-mag-0845-2r1t-e4.pdf; Lead Free: Yes; Temperature: 0°C to +70°C; Octopart: https://octopart.com/0845-2r1t-e4-bel+fuse-10528446; Device Class L1: Connectors; Device Class L3: unset; RoHS: TRUE; ComponentLink2Description: Datasheet; Manufacturer Part Number: 0845-2R1T-E4; Temperature Range Low: 0°C; Package: 0
J3 = L829-1J1T-JM: MagJack 2.5GBASE-T | 1X1 | OG/Y LED | -40 to 85C | RoHS; MF: Bel Magnetic Solutions; MP: L829-1J1T-JM; DigiKey-Purchase-URL: https://snapeda.com/shop?store=DigiKey&id=2758678; SnapEDA_Link: https://www.snapeda.com/parts/L829-1J1T-JM/Bel%20Magnetic%20Solutions/view-part/2758678/?ref=snap; Digi-Key_Part_Number: 507-2068-ND; Package: None; Value: *
R53 R54 R108 = CMP-2002-03891-1: Part Number: RK73H1ETTP2200F; Manufacturer: KOA Speer

## Sheet 05-Switch_SFP_CM4_RJ45.SchDoc
size B; SheetNumber: 5; SheetTotal: 13
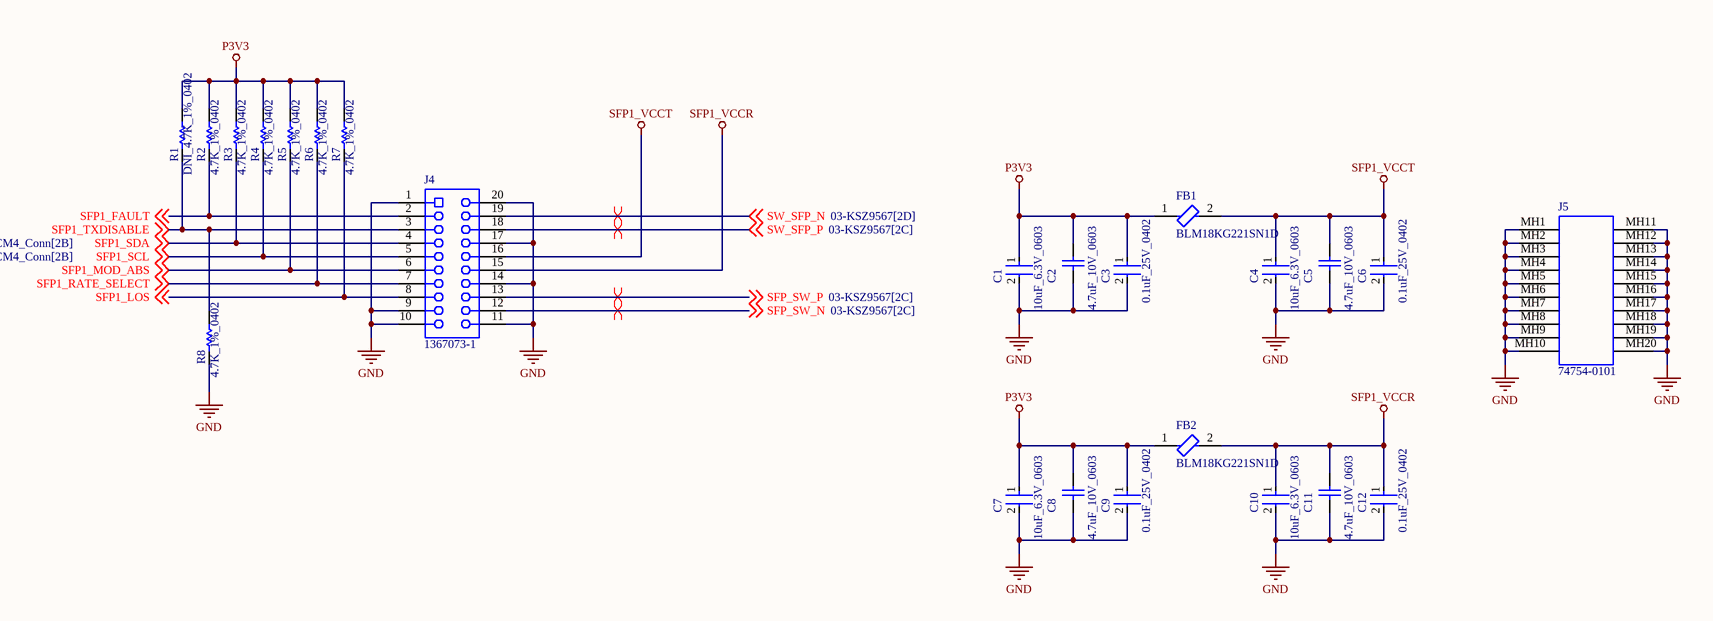
[diagram p3: 05-Switch_SFP_CM4_RJ45.SchDoc]

### Parts
C1  10uF_6.3V_0603  [FP-C0603C106M9PACTU-MFG]
C2  4.7uF_10V_0603  [CAPC1608X87X35NL15T15]
C3  0.1uF_25V_0402  [FP-0402-L_1_0_1-W_0_5_0_1-IPC_C]
C4  10uF_6.3V_0603  [FP-C0603C106M9PACTU-MFG]
C5  4.7uF_10V_0603  [CAPC1608X87X35NL15T15]
C6  0.1uF_25V_0402  [FP-0402-L_1_0_1-W_0_5_0_1-IPC_C]
C7  10uF_6.3V_0603  [FP-C0603C106M9PACTU-MFG]
C8  4.7uF_10V_0603  [CAPC1608X87X35NL15T15]
C9  0.1uF_25V_0402  [FP-0402-L_1_0_1-W_0_5_0_1-IPC_C]
C10  10uF_6.3V_0603  [FP-C0603C106M9PACTU-MFG]
C11  4.7uF_10V_0603  [CAPC1608X87X35NL15T15]
C12  0.1uF_25V_0402  [FP-0402-L_1_0_1-W_0_5_0_1-IPC_C]
FB1  BLM18KG221SN1D  [FP-BLM18-0_15-t0_8-IPC_B]
FB2  BLM18KG221SN1D  [FP-BLM18-0_15-t0_8-IPC_B]
J4  1367073-1  [TECO-1367073-1_V]
J5  74754-0101  [MOLX-74754-0101_V]
R1  DNI_4.7K_1%_0402  [RESC1005X40X25NL10T10]  (no BOM)
R2  4.7K_1%_0402  [RESC1005X40X25NL10T10]
R3  4.7K_1%_0402  [RESC1005X40X25NL10T10]
R4  4.7K_1%_0402  [RESC1005X40X25NL10T10]
R5  4.7K_1%_0402  [RESC1005X40X25NL10T10]
R6  4.7K_1%_0402  [RESC1005X40X25NL10T10]
R7  4.7K_1%_0402  [RESC1005X40X25NL10T10]
R8  4.7K_1%_0402  [RESC1005X40X25NL10T10]

### Nets
GND: C1.2 C2.1 C3.2 C4.2 C5.1 C6.2 C7.2 C8.1 C9.2 C10.2 C11.1 C12.2 J4.1 J4.9 J4.10 J4.11 J4.14 J4.17 J4.20 J5.MH1 J5.MH2 J5.MH3 J5.MH4 J5.MH5 J5.MH6 J5.MH7 J5.MH8 J5.MH9 J5.MH10 J5.MH11 J5.MH12 J5.MH13 J5.MH14 J5.MH15 J5.MH16 J5.MH17 J5.MH18 J5.MH19 J5.MH20 R8.2
P3V3: C1.1 C2.2 C3.1 C7.1 C8.2 C9.1 FB1.1 FB2.1 R1.1 R2.1 R3.1 R4.1 R5.1 R6.1 R7.1
SFP1_VCCR: C10.1 C11.2 C12.1 FB2.2 J4.15
SFP1_VCCT: C4.1 C5.2 C6.1 FB1.2 J4.16
SFP1_FAULT: J4.2 R2.2 ; off-sheet SFP1_FAULT
SFP1_LOS: J4.8 R7.2 ; off-sheet SFP1_LOS
SFP1_MOD_ABS: J4.6 R5.2 ; off-sheet SFP1_MOD_ABS
SFP1_RATE_SELECT: J4.7 R6.2 ; off-sheet SFP1_RATE_SELECT
SFP1_SCL: J4.5 R4.2 ; off-sheet SFP1_SCL
SFP1_SDA: J4.4 R3.2 ; off-sheet SFP1_SDA
SFP1_TXDISABLE: J4.3 R1.2 R8.1 ; off-sheet SFP1_TXDISABLE
SFP_SW_N: J4.12 ; off-sheet SFP_SW_N
SFP_SW_P: J4.13 ; off-sheet SFP_SW_P
SW_SFP_N: J4.19 ; off-sheet SW_SFP_N
SW_SFP_P: J4.18 ; off-sheet SW_SFP_P

### Layout directives
differential pair: SFP_SW_N, SFP_SW_P, SW_SFP_N, SW_SFP_P

### Library data of the parts
C1 C4 C7 C10 = CMP-2006-02285-3: CAP CER 10UF 6.3V X5R 0603; Manufacturer Part Number: C0603C106M9PACTU; Manufacturer: Kemet; Material: Ceramic; Temperature Coefficient: 15%; Tolerance: 20%; Category: Cap; Height: 0.9mm; Digikey Description: CAP CER 10UF 6.3V X5R 0603; Mouser Description: In a Pack of 10, KEMET 0603 (1608M) 10µF MLCC 6.3V dc ±20% SMD C0603C106M9PACTU; Voltage Rating: 6.3V; Device Class L2: Capacitors; Temperature Range Low: -55°C; Temperature Characteristic: X5R; ComponentLink2Description: Datasheet; Ipc Land Pattern Name: CAPC16080X80; ComponentLink2URL: http://www.kemet.com/Lists/ProductCatalog/Attachments/19/KEM_C1006_X5R_SMD.pdf; Capacitance: 10uF; Temperature Range High: +85°C; Device Class L3: Ceramic Capacitors; RoHS: TRUE; Automotive: No; Value: 10uF; Temperature: -55°C to +85°C; Device Class L1: Passive Components; Package: C0603C106M9PACTU; Lead Free: Yes; Octopart: https://octopart.com/c0603c106m9pactu-kemet-8375727
C2 C5 C8 C11 = CMP-2006-03238-1: Part Number: C0603C475K8PACTU; Manufacturer: Kemet
C3 C6 C9 C12 = CMP-2008-02519-2: General Purpose Ceramic Capacitor, 0402, 100nF, 10%, X7R, 15%, 25V; Package Quantity: 1; Capacitance: 100nF; Min Operating Temperature: -55°C; Voltage: 25V; Voltage Rating: 25V; Construction: Flat; Max Operating Temperature: 125°C; Radiation Hardening: No; Depth: 0.5mm; Thickness: 0.022inch; Voltage Rating (DC): 25V; Number of Pins: 2; Lead Free: Lead Free; Series: -; REACH SVHC: No SVHC; Length: 1mm; Dielectric: X7R; RoHS Compliant: Yes; Mount: Surface Mount; Packaging: Tape and Reel; Case/Package: 0402; Case Code (Imperial): 0402; Termination: SMD/SMT; Width: 0.02inch; Case Code (Metric): 1005; Tolerance: 10%
FB1 FB2 = CMP-0686-00556-7: Chip Ferrite Bead, 0603, 220Ω @ 100MHz, 0.05Ω, 25%, 2.2A; DC Resistance (DCR): 50mR; Number of Circuits: 1; Impedance: 220R; Current Rating: 2.2A; Material: Ferrite; Test Frequency: 100MHz; Depth: 0.8mm; Series: BLM18K; RoHS Compliant: Yes; Termination: SMD/SMT; Max Current Rating: 2.2A; Case Code (Metric): 1608; Radiation Hardening: No; Number of Pins: 2; Length: 1.6mm; Lead Free: Lead Free; Package Quantity: 1; Height: 0.8mm; Core Material: Ferrite; Inductor Type: FERRITE BEAD; Min Operating Temperature: -55°C; Case/Package: 0603; Case Code (Imperial): 0603; Number of Lines: 1; Packaging: Tape and Reel; REACH SVHC: No SVHC; Max Operating Temperature: 125°C; Military Standard: Not; DC Resistance-Max: 50mR; Width: 0.8mm; DC Current: 2.2A; Max DC Current: 2.2A; Tolerance: 25%; Weight: 7.1E-05oz
J4 = CMP-2000-05488-1: Female Connector, Pitch 0.8 mm, 2 x 10 Position, Height 5.4 mm, -55 to 85 degC, RoHS, Tape and Reel; Manufacturer: TE Connectivity; Product Training Modules: HighSpeedPluggableI/OSolutions; 3D Model: 1367073-1.pdf; Connector Type: SFP; Other Names: A97430DKR; Mating Products: 516-2084-ND / -TXRXOPTICALSFF1.25GBDISCSI; Dynamic Catalog: SFPConnectors; Featured Product: HighSpeedPluggableI-OSolutions; Connector Style: Receptacle; Associated Product: A103997CT-ND / -CONNSFPCAGESINGLEW/OPIPE / A103997TR-ND / -CONNSFPCAGESINGLEW/OPIPE / 1367645-3-ND / -CONNCAGE&HEATSINKSGLPORTTIN / 1367645-2-ND / -CONNCAGE&HEATSINKSGLPORTTIN / 1888424-1-ND / -CONNCAGE1X2SFPENHANCEDEMI / 1367643-1-ND / -CONNCAGESNGLPORTDBLSIDETIN / 1489962-1-ND / -CONNSFPCAGESINGLEW/OPIPE / 1367645-1-ND / -CONNCAGE&HEATSINKSGLPORTTIN / A99375-ND / -CONNSFPCAGE1X4PIN-IN-PASTE / A97412CT-ND / -CONNSFPLOWERCAGEPCB / More...; Number of Positions: 20; Package Reference: 1367073-1; Package Description: Female Connector, Pitch 0.8 mm, 2 x 10 Position, Height 5.4 mm; RoHS Information: 1367073-1StatementofCompliance; Contact Finish: Gold; Datasheet URL: http://www.te.com/commerce/DocumentDelivery/DDEController?Action=showdoc&DocId=Customer+Drawing%7F1367073%7FK%7Fpdf%7FEnglish%7FENG_CD_1367073_K.pdf%7F1367073-1; Datasheet Version: Rev. K, 12/2012; Contact Finish Thickness: 15µin(0.38µm); Category: Connectors,Interconnects; Mounting Type: SurfaceMount,RightAngle; Mounting Technology: SurfaceMount; Packaging: Digi-Reel®; Manufacturer URL: http://www.te.com/; Family: PluggableConnectors; Standard Package: 1; Termination: Solder
J5 = CMP-1704-00003-3: SFP+ Cage, Single Port, Height 10.85 mm, Tail Height 3.05 mm, -40 to 85 degC, RoHS, Tray; RoHSCompliant: True; ComponentLink3URL: http://www.molex.com/pdm_docs/sd/747540101_sd.pdf; Width: 49 mm; Height: 10.85 mm; Mounting Technology: Through Hole; ComponentLink2Description: Datasheet; ComponentLink3Description: Package Specification; DatasheetVersion: Rev. Jul-15; Package Quantity: 1152; PackageDescription: SFP+ Cage, Single Port, Height 10.85 mm, Tail Height 3.05 mm; Radiation Hardening: No; PackageVersion: Rev. J, 02/2015; ComponentLink1Description: Manufacturer URL; PartNumber: 74754-0101; ComponentLink1URL: http://www.molex.com/; Packaging: Tray; Length: 15.9 mm; ComponentLink2URL: http://www.molex.com/webdocs/datasheets/pdf/en-us/0747540101_IO_CONNECTORS.pdf
R1-R8 = CMP-2002-05217-1: as R9 on sheet 01-CM4_Conn

## Sheet 06-CM4_USB_HDMI_SDCard.SchDoc
size B; SheetNumber: 6; SheetTotal: 13
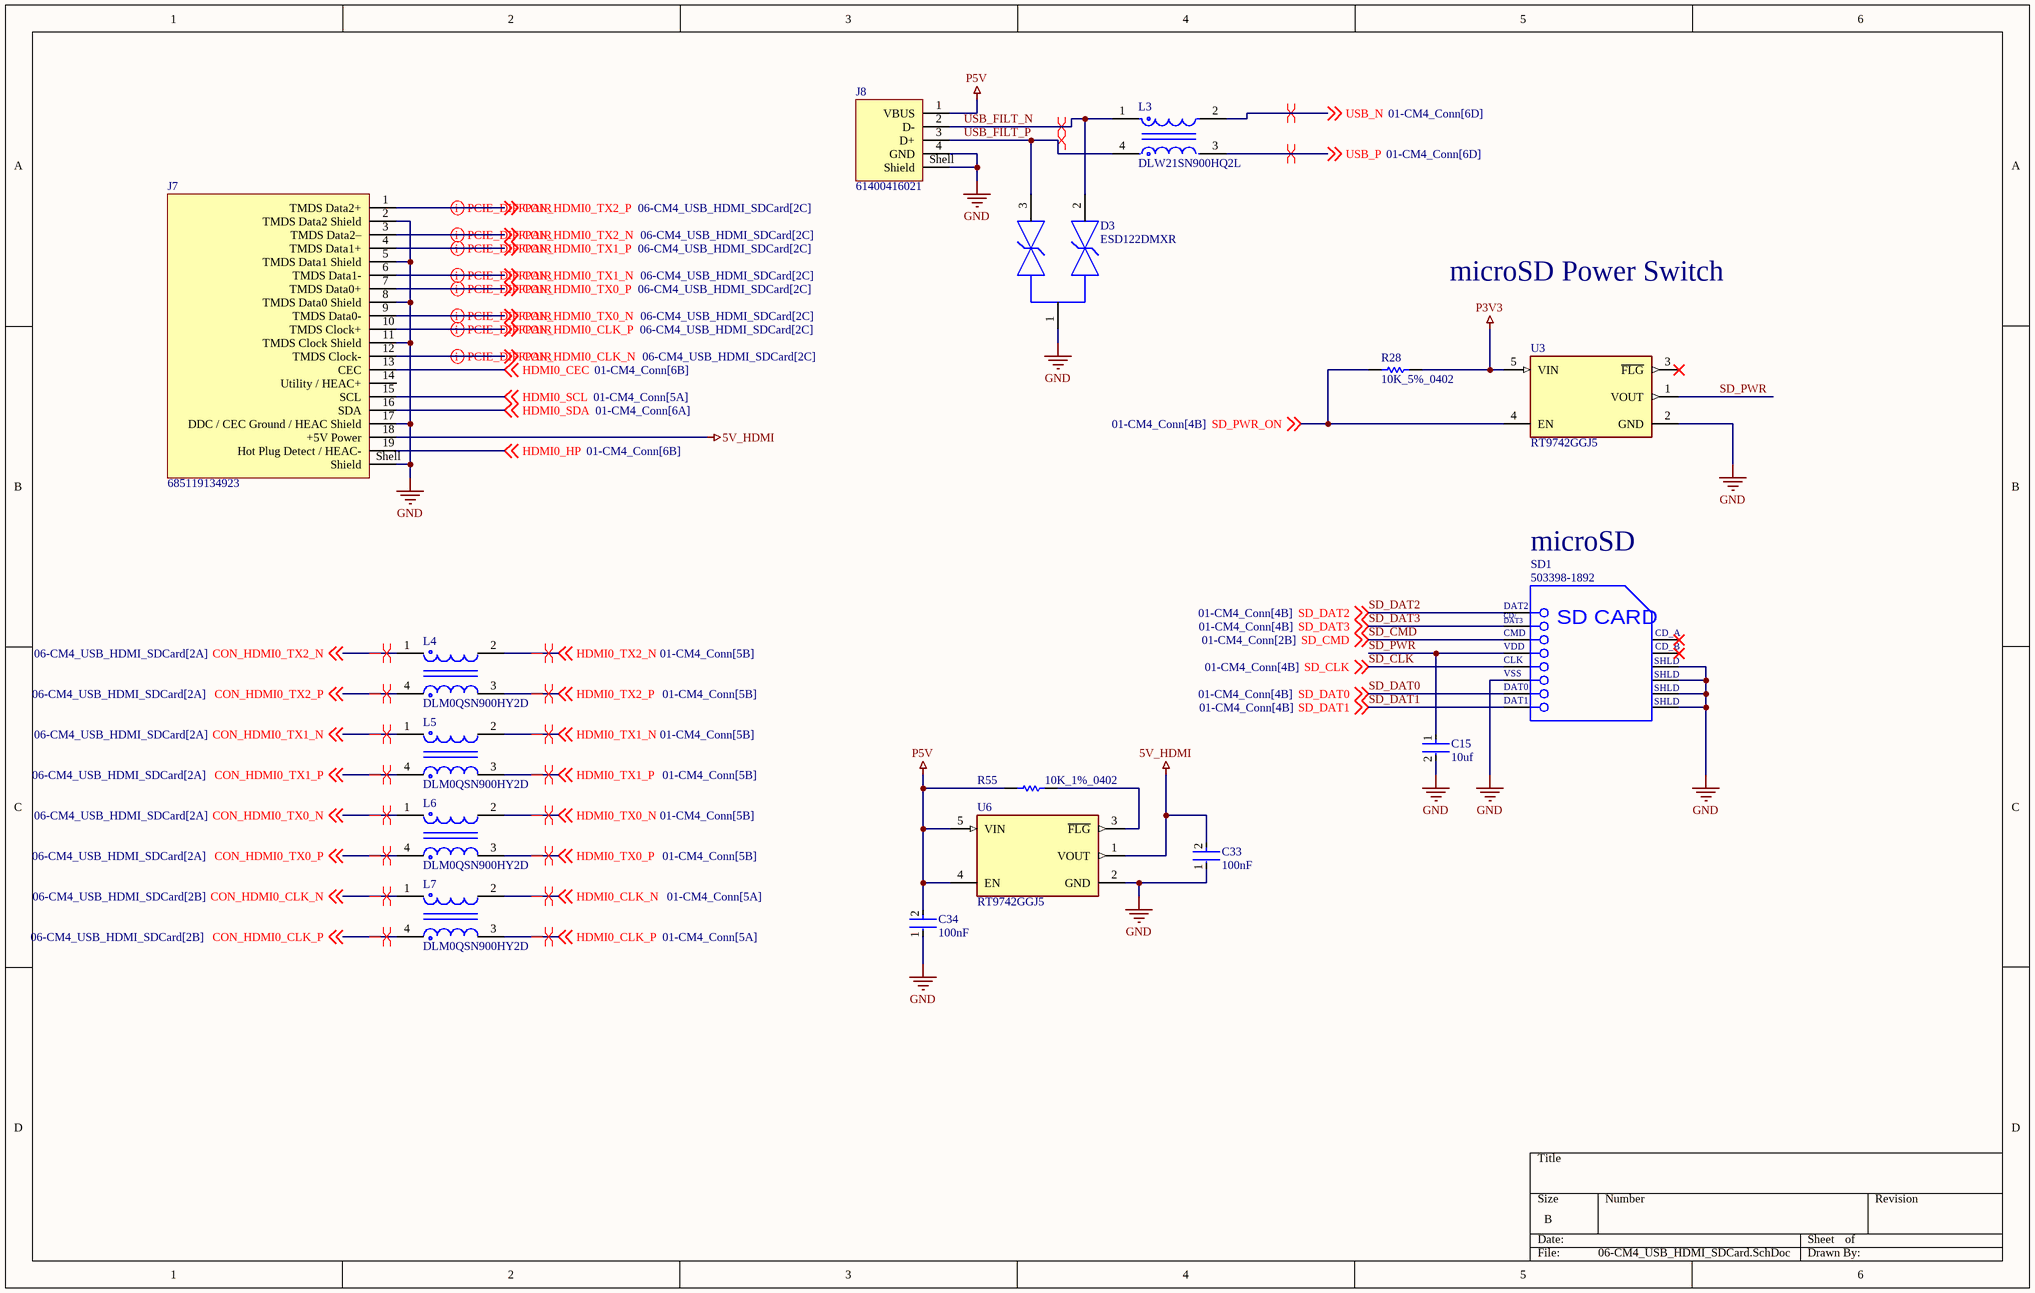
[diagram p4: 06-CM4_USB_HDMI_SDCard.SchDoc]

### Parts
C15  10uf  [FP-GRM188-0_2-IPC_C]
C33  100nF  [FP-GRM15-MFG]
C34  100nF  [FP-GRM15-MFG]
D3  ESD122DMXR  [FP-DMX0003A-MFG]
J7  685119134923  [685119134923]
J8  61400416021  [61400416021]
L3  DLW21SN900HQ2L  [FP-DLW21S-MFG]
L4  DLM0QSN900HY2D  [FP-DLM0Q-MFG]
L5  DLM0QSN900HY2D  [FP-DLM0Q-MFG]
L6  DLM0QSN900HY2D  [FP-DLM0Q-MFG]
L7  DLM0QSN900HY2D  [FP-DLM0Q-MFG]
R28  10K_5%_0402  [RESC1005X40X25ML05T05]
R55  10K_1%_0402  [RESC1005X40X25NL10T10]
SD1  503398-1892  [MOLX-503398-1892_V]
U3  RT9742GGJ5  [FP-RT9742GGJ5-IPC_C]
U6  RT9742GGJ5  [FP-RT9742GGJ5-IPC_C]

### Nets
5V_HDMI: C33.2 J7.18(+5V_Power) U6.1(VOUT)
GND: C15.2 C33.1 C34.1 D3.1(GND) J7.2(TMDS_Data2_Shield) J7.5(TMDS_Data1_Shield) J7.8(TMDS_Data0_Shield) J7.11(TMDS_Clock_Shield) J7.17(DDC_/_CEC_Ground_/_HEAC_Shield) J7.Shell(Shield) J8.4(GND) J8.Shell(Shield) SD1.6(VSS) SD1.11(SHLD) SD1.12(SHLD) SD1.13(SHLD) SD1.14(SHLD) U3.2(GND) U6.2(GND)
P3V3: R28.2 U3.5(VIN)
P5V: C34.2 J8.1(VBUS) R55.1 U6.4(EN) U6.5(VIN)
CON_HDMI0_CLK_N: J7.12(TMDS_Clock-) L7.1 ; off-sheet CON_HDMI0_CLK_N
CON_HDMI0_CLK_P: J7.10(TMDS_Clock+) L7.4 ; off-sheet CON_HDMI0_CLK_P
CON_HDMI0_TX0_N: J7.9(TMDS_Data0-) L6.1 ; off-sheet CON_HDMI0_TX0_N
CON_HDMI0_TX0_P: J7.7(TMDS_Data0+) L6.4 ; off-sheet CON_HDMI0_TX0_P
CON_HDMI0_TX1_N: J7.6(TMDS_Data1-) L5.1 ; off-sheet CON_HDMI0_TX1_N
CON_HDMI0_TX1_P: J7.4(TMDS_Data1+) L5.4 ; off-sheet CON_HDMI0_TX1_P
CON_HDMI0_TX2_N: J7.3(TMDS_Data2–) L4.1 ; off-sheet CON_HDMI0_TX2_N
CON_HDMI0_TX2_P: J7.1(TMDS_Data2+) L4.4 ; off-sheet CON_HDMI0_TX2_P
HDMI0_CEC: J7.13(CEC) ; off-sheet HDMI0_CEC
HDMI0_CLK_N: L7.2 ; off-sheet HDMI0_CLK_N
HDMI0_CLK_P: L7.3 ; off-sheet HDMI0_CLK_P
HDMI0_HP: J7.19(Hot_Plug_Detect_/_HEAC-) ; off-sheet HDMI0_HP
HDMI0_SCL: J7.15(SCL) ; off-sheet HDMI0_SCL
HDMI0_SDA: J7.16(SDA) ; off-sheet HDMI0_SDA
HDMI0_TX0_N: L6.2 ; off-sheet HDMI0_TX0_N
HDMI0_TX0_P: L6.3 ; off-sheet HDMI0_TX0_P
HDMI0_TX1_N: L5.2 ; off-sheet HDMI0_TX1_N
HDMI0_TX1_P: L5.3 ; off-sheet HDMI0_TX1_P
HDMI0_TX2_N: L4.2 ; off-sheet HDMI0_TX2_N
HDMI0_TX2_P: L4.3 ; off-sheet HDMI0_TX2_P
SD_CLK: SD1.5(CLK) ; off-sheet SD_CLK
SD_CMD: SD1.3(CMD) ; off-sheet SD_CMD
SD_DAT0: SD1.7(DAT0) ; off-sheet SD_DAT0
SD_DAT1: SD1.8(DAT1) ; off-sheet SD_DAT1
SD_DAT2: SD1.1(DAT2) ; off-sheet SD_DAT2
SD_DAT3: SD1.2(CD/DAT3) ; off-sheet SD_DAT3
SD_PWR: C15.1 SD1.4(VDD) U3.1(VOUT)
SD_PWR_ON: R28.1 U3.4(EN) ; off-sheet SD_PWR_ON
USB_FILT_N: D3.2(IO1) J8.2(D-) L3.1
USB_FILT_P: D3.3(IO2) J8.3(D+) L3.4
USB_N: L3.2 ; off-sheet USB_N
USB_P: L3.3 ; off-sheet USB_P
NetR55_2: R55.2 U6.3(~{FLG})

Not connected (* = marked no-connect by the designer): J7 14(Utility_/_HEAC+); SD1 9(CD_A)* 10(CD_B)*; U3 3(~{FLG})*

### Layout directives
differential pair; differential pair class HDMI: CON_HDMI0_CLK_N, CON_HDMI0_CLK_P, CON_HDMI0_TX0_N, CON_HDMI0_TX0_P, CON_HDMI0_TX1_N, CON_HDMI0_TX1_P, CON_HDMI0_TX2_N, CON_HDMI0_TX2_P
differential pair: CON_HDMI0_CLK_N, CON_HDMI0_CLK_P, CON_HDMI0_TX0_N, CON_HDMI0_TX0_P, CON_HDMI0_TX1_N, CON_HDMI0_TX1_P, CON_HDMI0_TX2_N, CON_HDMI0_TX2_P, HDMI0_CLK_N, HDMI0_CLK_P, HDMI0_TX0_N, HDMI0_TX0_P, HDMI0_TX1_N, HDMI0_TX1_P, HDMI0_TX2_N, HDMI0_TX2_P, USB_FILT_N, USB_FILT_P, USB_N, USB_P

### Notes on the sheet
- microSD Power Switch
- microSD
- (in symbol CMP-2000-05621-1) CD/; DAT3; SD CARD

### Library data of the parts
C15 = CMP-06035-045466-1: Chip Multilayer Ceramic Capacitors for General Purpose, 0603, 10uF, X5R, 15%, 20%, 35V; Case Code (Imperial): 0603; Voltage Rating (DC): 35V; Width: 0.031inch; Dielectric: X5R; Voltage Rating: 35V; Min Operating Temperature: -55°C; Thickness: 0.039inch; Mount: Surface Mount; Case/Package: 0603; Length: 0.063inch; Capacitance: 10uF; Max Operating Temperature: 85°C; Packaging: Tape and Reel; Tolerance: 20%; Case Code (Metric): 1608
C33 C34 = CMP-2100-03641-2: CAP CER 0.1UF 16V X7R 0402; Manufacturer Part Number: GRM155R71C104KA88D; Manufacturer: Murata; Standoff Height: 0mm; Tolerance: 10%; Voltage Rating: 16Vdc; Material: Ceramic; Capacitance: 0.10μF; Value: 0.10μF; RoHS: TRUE; Temperature Characteristic: X7R; Octopart: https://octopart.com/grm155r71c104ka88d-murata-196880; Digikey Description: CAP CER 0.1UF 16V X7R 0402; Device Class L3: Ceramic Capacitors; Height: 0.55mm; ComponentLink2Description: Datasheet; Temperature Range Low: -55°C; Ipc Land Pattern Name: CAPC10050X219; ComponentLink2URL: https://search.murata.co.jp/Ceramy/image/img/A01X/G101/ENG/GRM155R71H471KA01-01A.pdf; Device Class L1: Passive Components; Lead Free: yes; Category: Cap; Package: GRM15; Temperature: -55°C to +125°C; Device Class L2: Capacitors; Temperature Range High: +125°C; Mouser Description: 0402 0.1 uF 16V ±10 % Tolerance X7R SMT Multilayer Ceramic Capacitor
D3 = CMP-04989-000013-1: TVS DIODE 3.6V 8.4V 3X2SON; Peak Pulse Power: 20W; Min Breakdown Voltage: 5.1V; Average Rectified Current: 10A; Element Configuration: Common Cathode; Number of Channels: 2; Max Reverse Voltage (DC): 100V; Interface: USB; Power Line Protection: No; Peak Pulse Current: 2.5A; Clamping Voltage: 8.4V; Min Operating Temperature: -40°C; Number of Pins: 3; Resistor Type: Zener; Mount: Through Hole; Case/Package: TO-220-3; Reverse Standoff Voltage: 3.6V; RoHS Compliant: Yes; Max Operating Temperature: 125°C; Number of Bidirectional Channels: 2; Packaging: Rail/Tube
J7 = CMP-1502-00169-3: NexarPartId: 18818285; Connector Type: HDMI; Contact Resistance: 30mΩ; Current Rating: 500mA; Gender: Receptacle; Insulation Resistance: 10MΩ; Number of Contacts: 19; Body Material: Plastic; Voltage Rating: 40V; REACH SVHC: Unknown; Length: 12.15mm; Orientation: Horizontal; Packaging: Tape and Reel; Number of Pins: 19; Min Operating Temperature: -25°C; Termination: SMD/SMT; Height: 5.55mm; Features: Shielded; Number of Positions: 19; Width: 15mm; Mount: Horizontal, Surface Mount; Color: Black; Contact Material: Bronze, Gold; RoHS: Compliant; Max Operating Temperature: 85°C
J8 = CMP-1502-03227-2: NexarPartId: 21041530; Contact Resistance: 20mΩ; Gender: Receptacle; Voltage Rating (DC): 30V; Current Rating: 1.5A; Connector Type: USB; Insulation Resistance: 1GΩ; USB Standard: USB 2.0; Number of Contacts: 4; Number of Ports: 1; Width: 14.4mm; REACH SVHC: Unknown; Contact Plating: Gold; Length: 15.8mm; Lead Free: Lead Free; Max Operating Temperature: 105°C; Orientation: Horizontal; Contact Material: Copper; Voltage Rating: 30V; Min Operating Temperature: -40°C; Flammability Rating: UL94 V-0; Color: White; RoHS: Compliant; Number of Pins: 4; Mount: Horizontal, Through Hole; Number of Positions: 4; Operating Supply Voltage: 30V; Insulation Material: PBT; Termination: Solder
L3 = CMP-2000-06163-2: Common Mode Choke, 0805, 90Ω @ 100MHz, 0.41Ω, 25%, 280mA; Impedance: 90R; Shielding: Unshielded; DC Resistance (DCR): 410mR; Number of Lines: 2; RoHS Compliant: Yes; Series: EMIFIL®, DLW21S; Weight: 0.000388oz; Current Rating: 280mA; Case Code (Imperial): 0805; Termination: SMD/SMT; Lead Free: Lead Free; Width: 0.047inch; Height: 0.055inch; Package Quantity: 1; Radiation Hardening: No; Depth: 1.4mm; Packaging: Tape and Reel; Current: 280mA; REACH SVHC: No SVHC; Test Frequency: 100MHz; DC Current: 280mA; Max Operating Temperature: 85°C; Case/Package: 0805; Min Operating Temperature: -40°C; Max DC Current: 280mA; Tolerance: 25%; Resistor Type: Wirewound; Length: 2mm; Mount: Surface Mount; Military Standard: Not
L4-L7 = CMP-06045-000424-1: Chip Common Mode Choke Coil Monolithic 025020 50mA 90Ohm @ 100MHz; Impedance: 90R; Length: 650um; Width: 500um
R28 = CMP-2002-00433-1: Part Number: ERJ-2GEJ103X; Manufacturer: Panasonic
R55 = CMP-2002-04694-1: as R52 on sheet 01-CM4_Conn
SD1 = CMP-2000-05621-1: Micro SD Connector, Pitch 1.1 mm, 8 Position, Height 1.4 mm, -25 to 85 degC, RoHS, Tape and Reel; Manufacturer: Molex; Voltage Rating: 10VAC/DC; Current Rating: 500mA; Manufacturer URL: http://www.molex.com/; Package Reference: 503398-1892; Packaging: Reel; RoHS: Details; Brand: Molex; Datasheet URL: http://www.molex.com/pdm_docs/sd/5033981892_sd.pdf; Mounting Technology: SurfaceMount; Factory Pack Quantity: 2400; Datasheet Version: Rev. E, 04/2006; Series: 503398; Product Category: MemoryCardConnectors; Package Description: Micro SD Connector, Pitch 1.1 mm, 8 Position, Height 1.4 mm
U3 U6 = CMP-79883-000001-1: IC PWR SWTCH N-CHAN 1:1 TSOT23-5; Interface: On/Off; Fault Protection: Over Temperature; Max Output Current: 1A; Number of Outputs: 1; Output Configuration: High Side; On-State Resistance: 70mR; REACH SVHC: No SVHC; Number of Pins: 23; Packaging: Tape and Reel; Case/Package: SOT-23-5; RoHS Compliant: Yes; Max Operating Temperature: 85°C; Min Operating Temperature: -40°C